# Altium project E17-04-BMS.PrjPcb (part 1 of 2)
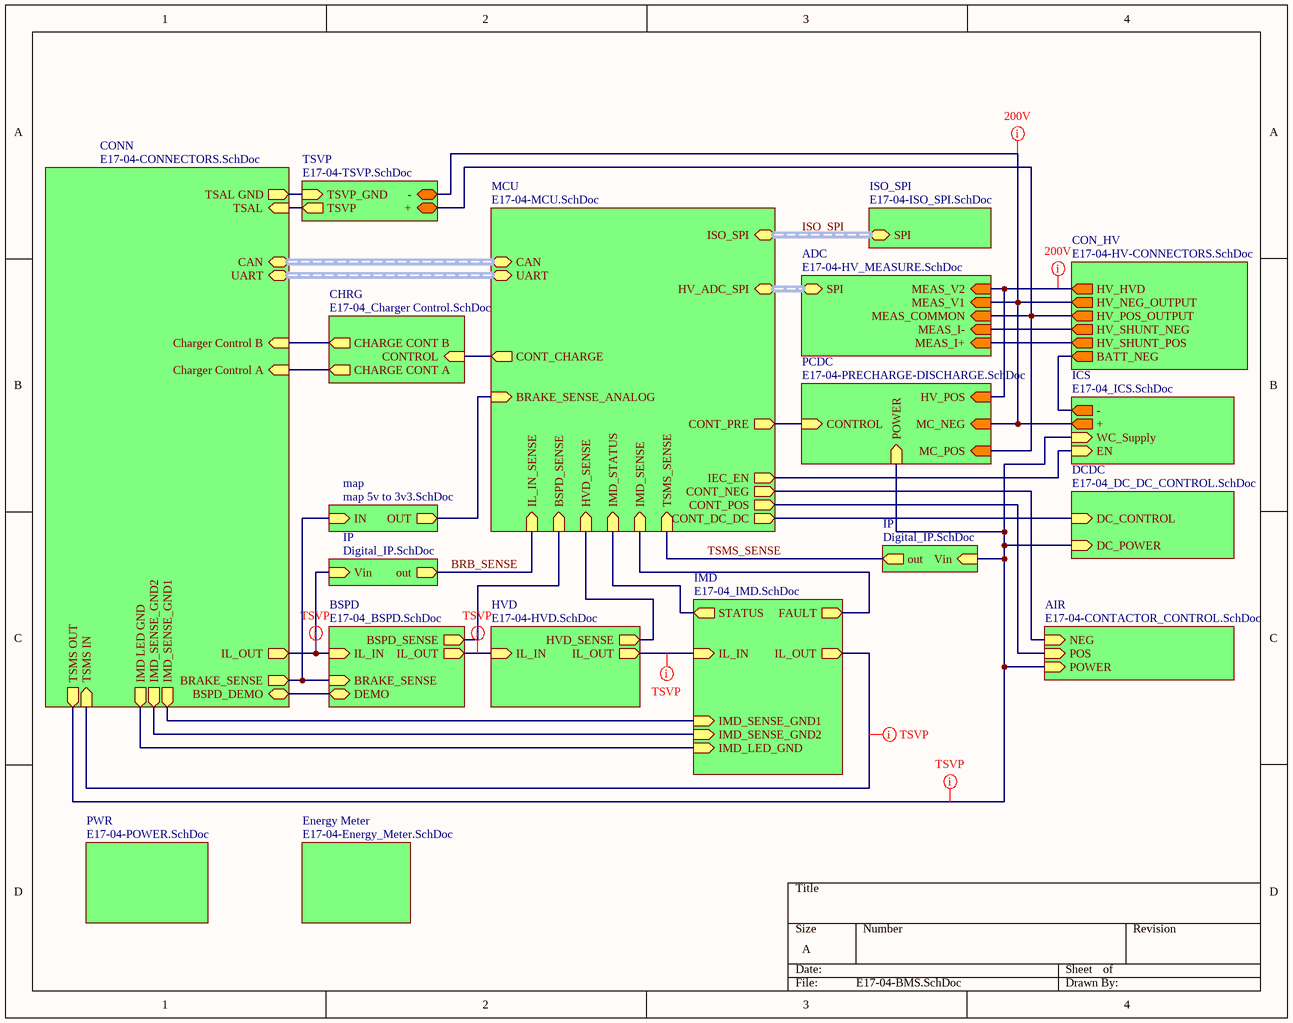
[diagram p0: E17-04-BMS.SchDoc]
20 sheets, 218 parts. Net scope: hierarchical (ports join the sheet entries above them; power ports are global).
Board file: E17-04-PCB.PcbDoc
Sheets:
  E17-04-BMS.SchDoc
    CONN = E17-04-CONNECTORS.SchDoc
      IP = Digital_IP.SchDoc
    BSPD = E17-04_BSPD.SchDoc
      IP = Digital_IP.SchDoc
    IMD = E17-04_IMD.SchDoc
      IP = Digital_IP.SchDoc
      IP = Digital_IP.SchDoc
    PCDC = E17-04-PRECHARGE-DISCHARGE.SchDoc
      SW = E17-04-INDUCTIVE_LOAD_SWITCH.SchDoc
    AIR = E17-04-CONTACTOR_CONTROL.SchDoc
      SW = E17-04-INDUCTIVE_LOAD_SWITCH.SchDoc
      SW = E17-04-INDUCTIVE_LOAD_SWITCH.SchDoc
    ISO_SPI = E17-04-ISO_SPI.SchDoc
    TSVP = E17-04-TSVP.SchDoc
    MCU = E17-04-MCU.SchDoc
    ADC = E17-04-HV_MEASURE.SchDoc
    PWR = E17-04-POWER.SchDoc
    HVD = E17-04-HVD.SchDoc
      IP = Digital_IP.SchDoc
    IP = Digital_IP.SchDoc
    CON_HV = E17-04-HV-CONNECTORS.SchDoc
    CHRG = E17-04_Charger Control.SchDoc
      SW = E17-04-INDUCTIVE_LOAD_SWITCH.SchDoc
    ICS = E17-04_ICS.SchDoc
      SW = E17-04-INDUCTIVE_LOAD_SWITCH.SchDoc
    IP = Digital_IP.SchDoc
    map = map 5v to 3v3.SchDoc
    Energy Meter = E17-04-Energy_Meter.SchDoc
    DCDC = E17-04_DC_DC_CONTROL.SchDoc
      SW = E17-04-INDUCTIVE_LOAD_SWITCH.SchDoc

## Sheet E17-04-BMS.SchDoc
size A; DocumentNumber: 1; SheetNumber: 1; SheetTotal: 18

### Sub-sheets
ADC = E17-04-HV_MEASURE.SchDoc: MEAS_V1 (in), MEAS_I- (in), MEAS_V2 (in), MEAS_I+ (in), MEAS_COMMON (in), SPI (harness SPI)
AIR = E17-04-CONTACTOR_CONTROL.SchDoc: POWER (in), POS (in), NEG (in)
BSPD = E17-04_BSPD.SchDoc: BRAKE_SENSE (in), IL_IN (in), IL_OUT (out), BSPD_SENSE (out), DEMO (bidir)
CHRG = E17-04_Charger Control.SchDoc: CHARGE CONT A (out), CONTROL (in), CHARGE CONT B (out)
CON_HV = E17-04-HV-CONNECTORS.SchDoc: HV_HVD (out), HV_NEG_OUTPUT (out), HV_POS_OUTPUT (out), HV_SHUNT_NEG (out), HV_SHUNT_POS (out), BATT_NEG (out)
CONN = E17-04-CONNECTORS.SchDoc: IL_OUT (out), BRAKE_SENSE (out), IMD LED GND (out), TSAL GND (out), TSAL (in), IMD_SENSE_GND1 (out), IMD_SENSE_GND2 (out), Charger Control A (in), Charger Control B (in), TSMS IN (in), TSMS OUT (out), CAN (harness CAN), UART (harness UART), BSPD_DEMO (bidir)
DCDC = E17-04_DC_DC_CONTROL.SchDoc: DC_CONTROL (in), DC_POWER (in)
Energy Meter = E17-04-Energy_Meter.SchDoc: no entries
HVD = E17-04-HVD.SchDoc: IL_OUT (out), IL_IN (in), HVD_SENSE (out)
ICS = E17-04_ICS.SchDoc: + (out), - (out), EN (in), WC_Supply (in)
IMD = E17-04_IMD.SchDoc: IL_IN (in), IL_OUT (out), FAULT (out), IMD_LED_GND (in), IMD_SENSE_GND2 (in), IMD_SENSE_GND1 (in), STATUS (out)
IP = Digital_IP.SchDoc: Vin (in), out (out)
IP = Digital_IP.SchDoc: Vin (in), out (out)
ISO_SPI = E17-04-ISO_SPI.SchDoc: SPI (harness SPI)
map = map 5v to 3v3.SchDoc: IN (in), OUT (out)
MCU = E17-04-MCU.SchDoc: IMD_SENSE (in), CONT_POS (out), CONT_PRE (out), CONT_NEG (out), IL_IN_SENSE (in), BSPD_SENSE (in), HVD_SENSE (in), TSMS_SENSE (in), CONT_CHARGE (out), IMD_STATUS (in), IEC_EN (out), CAN (harness CAN), HV_ADC_SPI (harness SPI), ISO_SPI (harness SPI), UART (harness UART), BRAKE_SENSE_ANALOG (in), CONT_DC_DC (out)
PCDC = E17-04-PRECHARGE-DISCHARGE.SchDoc: HV_POS (in), MC_POS (in), MC_NEG (in), CONTROL (in), POWER (in)
PWR = E17-04-POWER.SchDoc: no entries
TSVP = E17-04-TSVP.SchDoc: TSVP (out), TSVP_GND (in), -, +

### Nets
HV_COM: sheet PCDC/MC_POS, sheet TSVP/+, sheet ADC/MEAS_COMMON, sheet CON_HV/HV_POS_OUTPUT
+: sheet PCDC/MC_NEG, sheet TSVP/-, sheet ADC/MEAS_V1, sheet CON_HV/HV_NEG_OUTPUT, sheet ICS/+
-: sheet CON_HV/BATT_NEG, sheet ICS/-
~{IMD FAUL}T 3V3: sheet IMD/FAULT, sheet MCU/IMD_SENSE
BRAKE_SENSE: sheet CONN/BRAKE_SENSE, sheet BSPD/BRAKE_SENSE, sheet map/IN
BRAKE_SENSE_ANALOG: sheet MCU/BRAKE_SENSE_ANALOG, sheet map/OUT
BRB_SENSE: sheet MCU/IL_IN_SENSE, sheet IP/out
BSPD_DEMO: sheet CONN/BSPD_DEMO, sheet BSPD/DEMO
BSPD_SENSE: sheet BSPD/BSPD_SENSE, sheet MCU/BSPD_SENSE
CHARGE CONT A: sheet CONN/Charger Control A, sheet CHRG/CHARGE CONT A
CHARGE CONT B: sheet CONN/Charger Control B, sheet CHRG/CHARGE CONT B
CONT_CHARGE: sheet MCU/CONT_CHARGE, sheet CHRG/CONTROL
CONT_DC_DC: sheet MCU/CONT_DC_DC, sheet DCDC/DC_CONTROL
CONT_NEG: sheet AIR/NEG, sheet MCU/CONT_NEG
CONT_POS: sheet AIR/POS, sheet MCU/CONT_POS
CONT_PRE: sheet PCDC/CONTROL, sheet MCU/CONT_PRE
CONTROL: sheet MCU/IEC_EN, sheet ICS/EN
DC_POWER: sheet CONN/TSMS OUT, sheet PCDC/POWER, sheet AIR/POWER, sheet ICS/WC_Supply, sheet IP/Vin, sheet DCDC/DC_POWER
HV_HVD: sheet PCDC/HV_POS, sheet ADC/MEAS_V2, sheet CON_HV/HV_HVD
HV_SHUNT_NEG: sheet ADC/MEAS_I-, sheet CON_HV/HV_SHUNT_NEG
HV_SHUNT_POS: sheet ADC/MEAS_I+, sheet CON_HV/HV_SHUNT_POS
HVD_SENSE: sheet MCU/HVD_SENSE, sheet HVD/HVD_SENSE
IL_IN: sheet CONN/IL_OUT, sheet BSPD/IL_IN, sheet IP/Vin
IL_IN: sheet BSPD/IL_OUT, sheet HVD/IL_IN  [a separate net that carries the same name]
IL_IN: sheet IMD/IL_IN, sheet HVD/IL_OUT  [a separate net that carries the same name]
IL_OUT: sheet CONN/TSMS IN, sheet IMD/IL_OUT
IMD LED GND: sheet CONN/IMD LED GND, sheet IMD/IMD_LED_GND
IMD_SENSE_GND1: sheet CONN/IMD_SENSE_GND1, sheet IMD/IMD_SENSE_GND1
IMD_SENSE_GND2: sheet CONN/IMD_SENSE_GND2, sheet IMD/IMD_SENSE_GND2
IMD_STATUS: sheet IMD/STATUS, sheet MCU/IMD_STATUS
TSAL: sheet CONN/TSAL, sheet TSVP/TSVP
TSAL GND: sheet CONN/TSAL GND, sheet TSVP/TSVP_GND
TSMS_SENSE: sheet MCU/TSMS_SENSE, sheet IP/out

### Buses and harness runs
harness ISO_SPI = sheet ISO_SPI/SPI = sheet MCU/ISO_SPI
harness sheet ADC/SPI = sheet MCU/HV_ADC_SPI
harness sheet CONN/CAN = sheet MCU/CAN
harness sheet CONN/UART = sheet MCU/UART

### Layout directives
rule Clearance Constraint [Generic clearance = 0.4mm, and 3 value(s) for objects]: +, HV_HVD
rule Undefined; rule Width Constraint [Pref Width = 25mil    Min Width = 20mil    Max Width = 30mil]: DC_POWER, IL_IN, IL_OUT

## Sheet E17-04-CONNECTORS.SchDoc
size A; DocumentNumber: 11; SheetNumber: 11; SheetTotal: 18
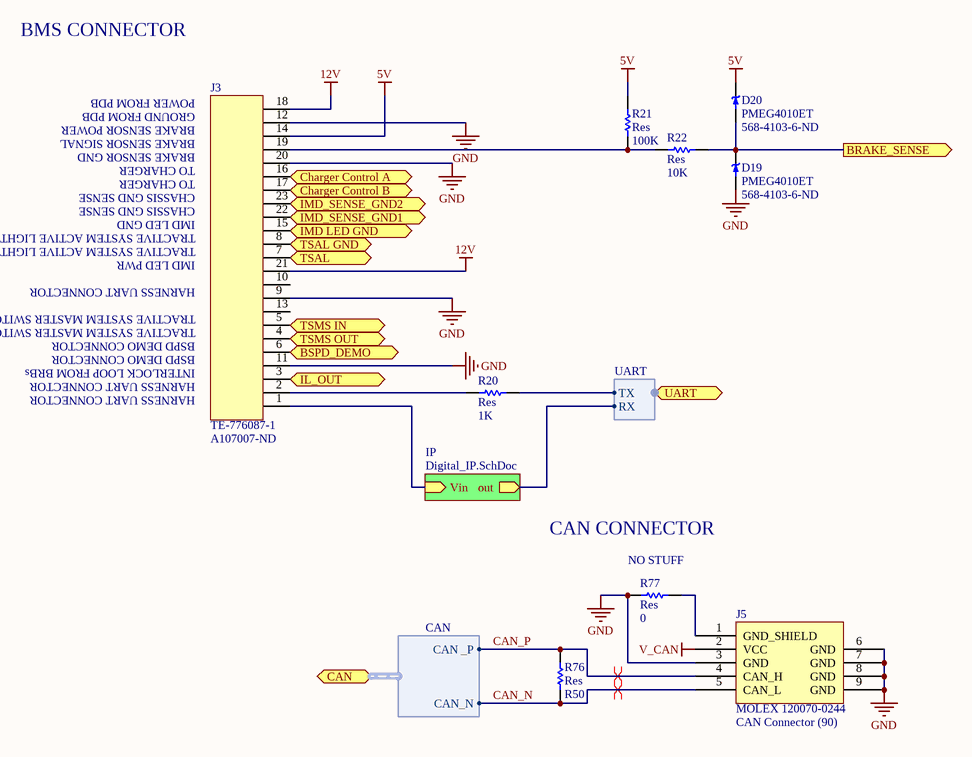
[diagram p1: E17-04-CONNECTORS.SchDoc]

### Parts
D19  PMEG4010ET  Supplier Part Number 1: 568-4103-6-ND  [SOT23-3]
D20  PMEG4010ET  Supplier Part Number 1: 568-4103-6-ND  [SOT23-3]
J3  TE-776087-1  Supplier Part Number 1: A107007-ND  [TE-776087-1]
J5  CAN Connector (90)  [CAN Connector (90)]
R20  Res  value 1K  [2012[0805]]
R21  Res  value 100K  [2012[0805]]
R22  Res  value 10K  [2012[0805]]
R76  Res  value R50  [2012[0805]]
R77  Res  value 0  [2012[0805]]

### Sub-sheets
IP = Digital_IP.SchDoc: Vin (in), out (out)

### Ports
BRAKE_SENSE (out), BSPD_DEMO (bidir), CAN (harness CAN), Charger Control A (out), Charger Control B (out), IL_OUT (out), IMD LED GND (out), IMD_SENSE_GND1 (out), IMD_SENSE_GND2 (out), TSAL (in), TSAL GND (in), TSMS IN, TSMS OUT, UART (harness UART)

### Harnesses
CAN: CAN _P, CAN_N
UART: RX, TX

### Nets
5V: D20.3 J3.14 R21.1
12V: J3.18 J3.21
GND: D19.1 J3.9 J3.11 J3.12 J3.20 J5.3(GND) J5.6(GND) J5.7(GND) J5.8(GND) J5.9(GND) R77.2
V_CAN: J5.2(VCC)
BRAKE_SENSE: D19.3 D20.1 R22.2 ; port BRAKE_SENSE
BSPD_DEMO: J3.6 ; port BSPD_DEMO
CAN_N: J5.5(CAN_L) R76.1 ; port CAN.CAN_N
CAN_P: J5.4(CAN_H) R76.2 ; port CAN.CAN _P
CHARGE CONT A: J3.16 ; port Charger Control A
CHARGE CONT B: J3.17 ; port Charger Control B
DC_POWER: J3.4 ; port TSMS OUT
IL_IN: J3.3 ; port IL_OUT
IL_OUT: J3.5 ; port TSMS IN
IMD LED GND: J3.15 ; port IMD LED GND
IMD_SENSE_GND1: J3.22 ; port IMD_SENSE_GND1
IMD_SENSE_GND2: J3.23 ; port IMD_SENSE_GND2
out: sheet IP/out, port UART.RX
TSAL: J3.7 ; port TSAL
TSAL GND: J3.8 ; port TSAL GND
Vin: J3.1 ; sheet IP/Vin
NetJ3_2: J3.2 R20.1
NetJ3_19: J3.19 R21.2 R22.1
NetJ5_1: J5.1(GND_SHIELD) R77.1
NetPB1_58: R20.2 ; port UART.TX

Not connected (* = marked no-connect by the designer): J3 10 13

### Layout directives
differential pair: CAN_N, CAN_P

### Notes on the sheet
- BMS CONNECTOR
- POWER FROM PDB
- GROUND FROM PDB
- BRAKE SENSOR POWER
- BRAKE SENSOR SIGNAL
- BRAKE SENSOR GND
- TO CHARGER
- CHASSIS GND SENSE
- IMD LED GND
- TRACTIVE SYSTEM ACTIVE LIGHT
- IMD LED PWR
- TRACTIVE SYSTEM MASTER SWITCH
- HARNESS UART CONNECTOR
- INTERLOCK LOOP FROM BRBs
- BSPD DEMO CONNECTOR
- CAN CONNECTOR
- (near R77) NO STUFF
- (in symbol CAN Connector (90)) MOLEX 120070-0244

### Library data of the parts
D19 D20 = PMEG4010ET: SCHOTTKY RECT 40V 1A SOT-23; Supplier 1: Digi-Key
J3 = TE-776087-1: CONN HDR RTANG 23POS W/GASKT TIN; Supplier 1: Digi-Key
R20-R22 R76 R77 = Res: Surface Mount Resistor; Published: 8-Jun-2000; LatestRevisionDate: 17-Jul-2002; LatestRevisionNote: Re-released for DXP Platform.; PackageReference: AXIAL-0.5; Publisher: Altium Limited
J5 = CAN Connector (90): Supplier 1: Mouser

## Sheet Digital_IP.SchDoc
size A; DocumentNumber: 15; SheetNumber: 15; SheetTotal: 18
Used 7 times, as channels CONN/IP, BSPD/IP, IMD/IP, IMD/IP, HVD/IP, IP, IP. Parts and nets are listed once, with the designators drawn on the sheet.
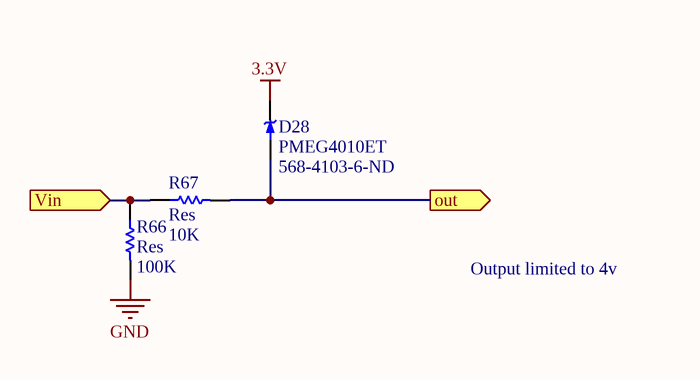
[diagram p2: Digital_IP.SchDoc]

### Parts
D28  PMEG4010ET  Supplier Part Number 1: 568-4103-6-ND  [SOT23-3]
R66  Res  value 100K  [2012[0805]]
R67  Res  value 10K  [2012[0805]]

### Ports
out (out), Vin (in)

### Nets
3.3V: D28.3
GND: R66.2
out: D28.1 R67.2 ; port out
Vin: R66.1 R67.1 ; port Vin

### Channels
CONN/IP: designators end in _CONN_IP; ports out=out Vin=Vin
BSPD/IP: designators D28=D17_IP1 R66=R66_BSPD_IP R67=R35_IP1; ports out=BSPD_SENSE Vin=IL_IN
IMD/IP: designators D28=D17_IP4 R66=R66_IMD_IP#1 R67=R35_IP4; ports out=~{IMD FAUL}T 3V3 Vin=~{IMD FAUL}T 12V
IMD/IP: designators D28=D17_IP3 R66=R66_IMD_IP#2 R67=R35_IP3; ports out=IMD_STATUS Vin=IMD_PWM+
HVD/IP: designators D28=D17_IP2 R66=R66_HVD_IP R67=R35_IP2; ports out=HVD_SENSE Vin=IL_IN
IP: designators D28=D17_IP5 R66=R66_IP#1 R67=R35_IP5; ports out=BRB_SENSE Vin=IL_IN
IP: designators D28=D17_IP6 R66=R66_IP#2 R67=R35_IP6; ports out=TSMS_SENSE Vin=DC_POWER

### Notes on the sheet
- Output limited to 4v

### Library data of the parts
D28 = PMEG4010ET: SCHOTTKY RECT 40V 1A SOT-23; Supplier 1: Digi-Key
R66 R67 = Res: Surface Mount Resistor; Published: 8-Jun-2000; LatestRevisionDate: 17-Jul-2002; LatestRevisionNote: Re-released for DXP Platform.; PackageReference: AXIAL-0.5; Publisher: Altium Limited

## Sheet E17-04_BSPD.SchDoc
size B; DocumentNumber: 10; SheetNumber: 10; SheetTotal: 18
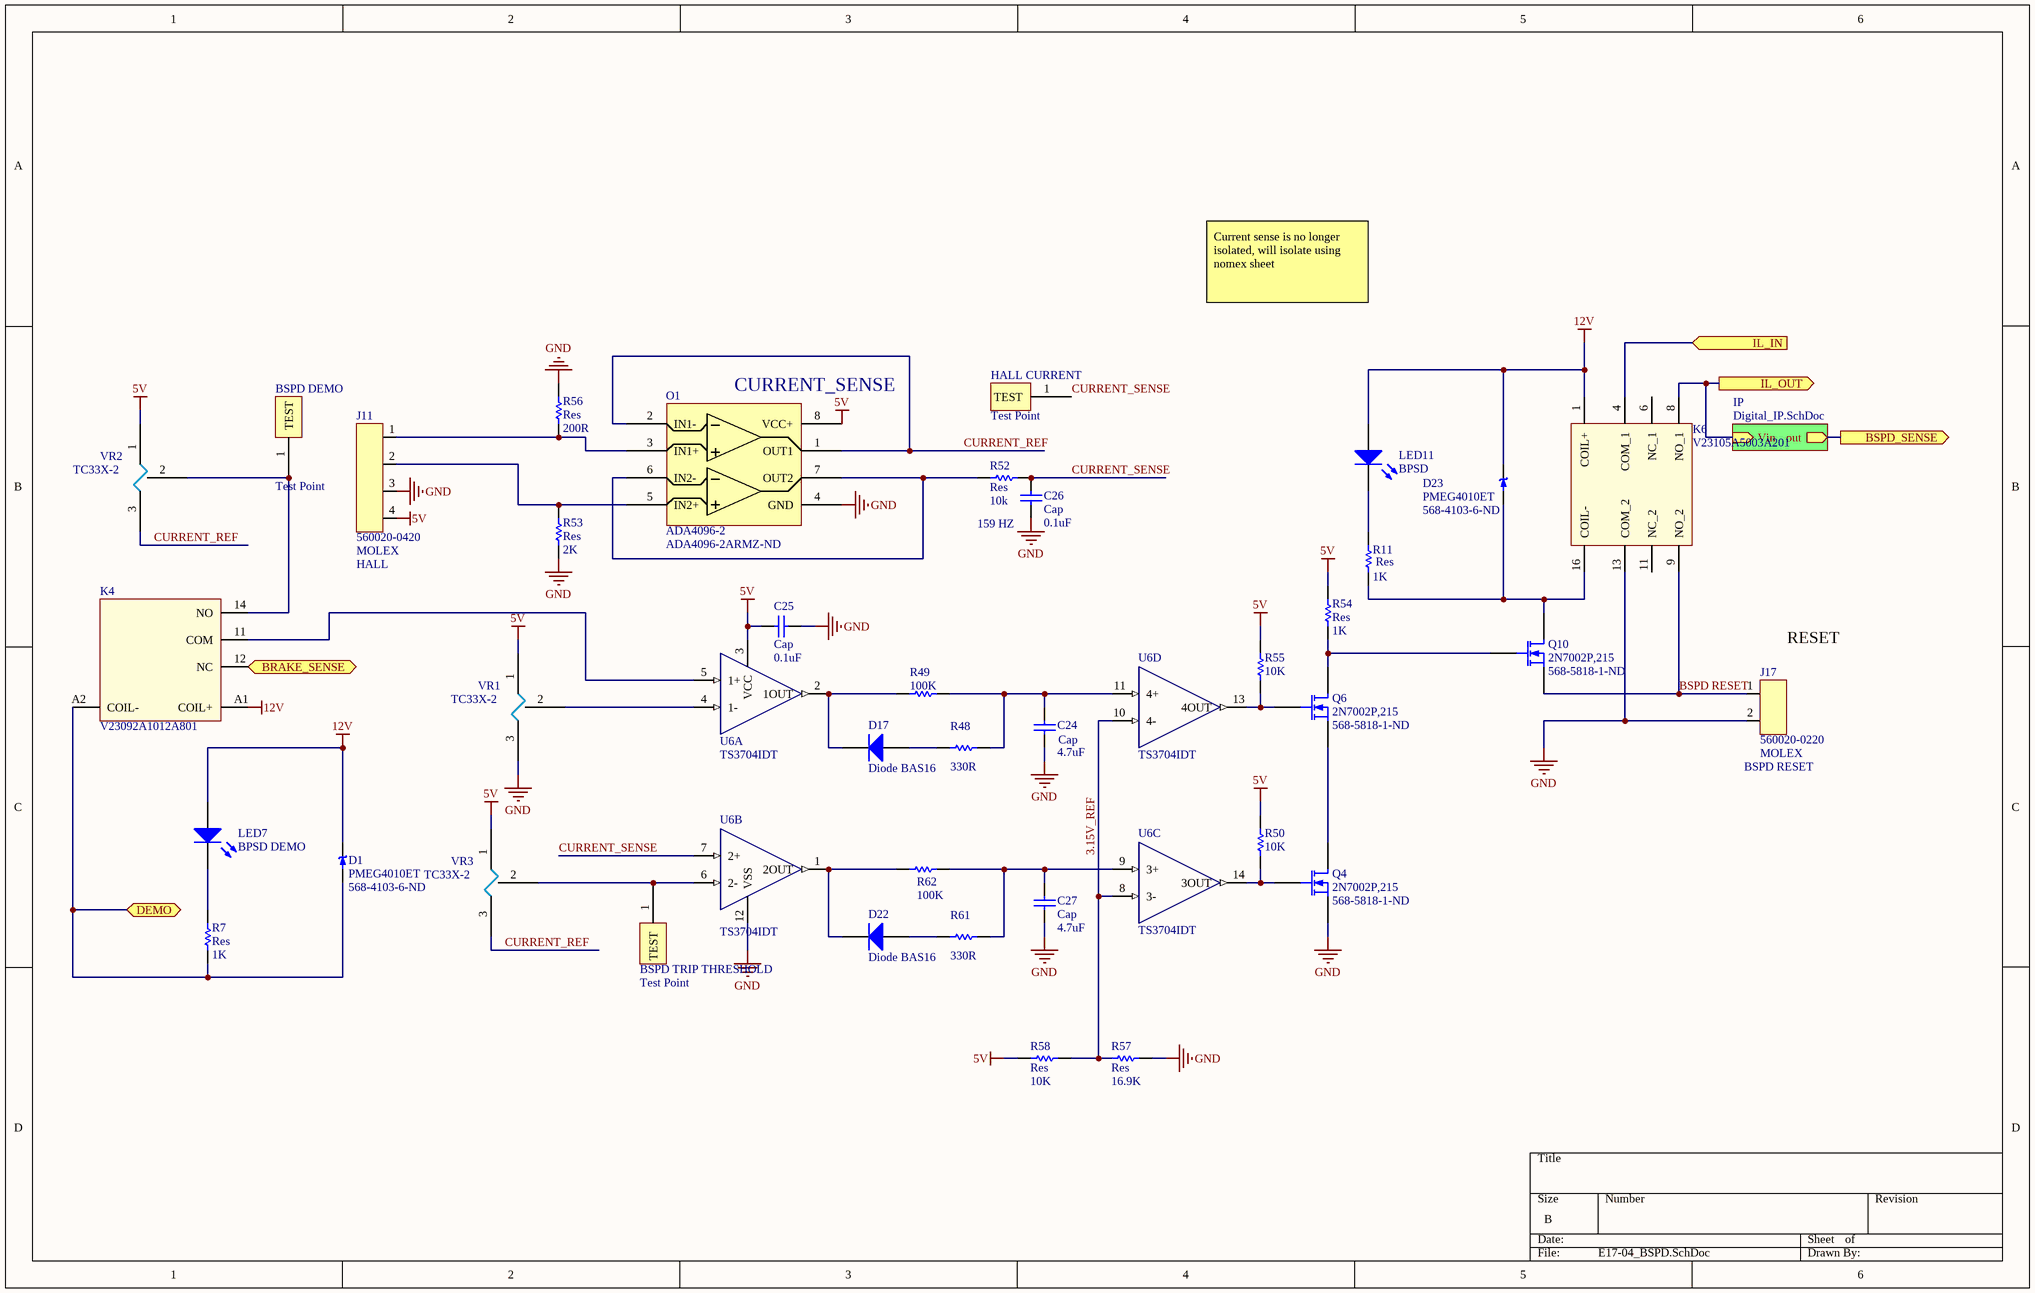
[diagram p3: E17-04_BSPD.SchDoc]

### Parts
BSPD_DEMO  Test Point  [TEST POINT 5000K]
BSPD_TRIP_THRESHOLD  Test Point  [TEST POINT 5000K]
C24  Cap  value 4.7uF  [C0805]
C25  Cap  value 0.1uF  [C0805]
C26  Cap  value 0.1uF  [C0805]
C27  Cap  value 4.7uF  [C0805]
D1  PMEG4010ET  Supplier Part Number 1: 568-4103-6-ND  [SOT23-3]
D17  Diode BAS16  [SOT-23_N]
D22  Diode BAS16  [SOT-23_N]
D23  PMEG4010ET  Supplier Part Number 1: 568-4103-6-ND  [SOT23-3]
HALL_CURRENT  Test Point  [TEST POINT 5000K]
J11  MANUFACTURER: MOLEX  [MOLEX_DURACLIK_4 NAT VERT]  (hidden comment: HALL)
J17  BSPD RESET  MANUFACTURER: MOLEX  [MOLEX_DURACLIK_2 NAT VERT]
K4  V23092A1012A801  [SCHRACK]
K6  MFG_PN: V23105A5003A201  [K_V23105A5003A201]  (hidden comment: K_V23105A5003A201)
LED7  BPSD DEMO  [155124VS73200]
LED11  BPSD  [155124VS73200]
O1  ADA4096-2  Supplier Part Number 1: ADA4096-2ARMZ-ND  [TSSOP8]
Q4  2N7002P,215  Supplier Part Number 1: 568-5818-1-ND  [SOT23-3]
Q6  2N7002P,215  Supplier Part Number 1: 568-5818-1-ND  [SOT23-3]
Q10  2N7002P,215  Supplier Part Number 1: 568-5818-1-ND  [SOT23-3]
R7  Res  value 1K  [2012[0805]]
R11  Res  value 1K  [2012[0805]]
R48  value 330R  [2012[0805]]  (hidden comment: Res)
R49  value 100K  [2012[0805]]  (hidden comment: Res)
R50  value 10K  [2012[0805]]  (hidden comment: Res)
R52  Res  value 10k  [2012[0805]]
R53  Res  value 2K  [2012[0805]]
R54  Res  value 1K  [2012[0805]]
R55  value 10K  [2012[0805]]  (hidden comment: Res)
R56  Res  value 200R  [2012[0805]]
R57  Res  value 16.9K  [2012[0805]]
R58  Res  value 10K  [2012[0805]]
R61  value 330R  [2012[0805]]  (hidden comment: Res)
R62  value 100K  [2012[0805]]  (hidden comment: Res)
U6  MFG_PN: TS3704IDT  [14-SOIC]  (hidden comment: U_TS3704IDT)  (parts A,B,C,D of 4)
VR1  TC33X-2  [TC33X-2]
VR2  TC33X-2  [TC33X-2]
VR3  TC33X-2  [TC33X-2]

### Sub-sheets
IP = Digital_IP.SchDoc: Vin (in), out (out)

### Ports
BRAKE_SENSE (in), BSPD_SENSE (out), DEMO (bidir), IL_IN (in), IL_OUT (out)

### Nets
5V: C25.2 J11.4 O1.8(VCC+) R50.2 R54.1 R55.2 R58.2 U6.3(VCC) VR1.1 VR2.1 VR3.1
12V: D1.3 D23.3 K4.A1(COIL+) K6.1(COIL+) LED7.2 LED11.2
GND: C24.1 C25.1 C26.1 C27.1 J11.3 J17.2 K6.13(COM_2) O1.4(GND) Q4.2(S) R53.1 R56.1 R57.1 U6.12(VSS) VR1.3
3.15V_REF: R57.2 R58.1 U6.8(3-) U6.10(4-)
BRAKE_SENSE: K4.12(NC) ; port BRAKE_SENSE
BSPD RESET: J17.1 K6.9(NO_2) Q10.2(S)
BSPD_DEMO: D1.1 K4.A2(COIL-) R7.1 ; port DEMO
BSPD_SENSE: port BSPD_SENSE, sheet IP/out
CURRENT_REF: O1.1(OUT1) O1.2(IN1-) VR2.3 VR3.3
CURRENT_SENSE: C26.2 HALL_CURRENT.1(TEST) R52.1 U6.7(2+)
IL_IN: K6.4(COM_1) ; port IL_IN
IL_IN: K6.8(NO_1) ; port IL_OUT, sheet IP/Vin  [a separate net that carries the same name]
NetBSPD_DEMO_1: BSPD_DEMO.1(TEST) K4.14(NO) VR2.2
NetBSPD_TRIP_THRESHOLD_1: BSPD_TRIP_THRESHOLD.1(TEST) U6.6(2-) VR3.2
NetC24_2: C24.2 R48.2 R49.2 U6.11(4+)
NetC27_2: C27.2 R61.2 R62.2 U6.9(3+)
NetD17_1: D17.1(A) R48.1
NetD17_3: D17.3(K) R49.1 U6.2(1OUT)
NetD22_1: D22.1(A) R61.1
NetD22_3: D22.3(K) R62.1 U6.1(2OUT)
NetD23_1: D23.1 K6.16(COIL-) Q10.3(D) R11.1
NetJ11_1: J11.1 O1.3(IN1+) R56.2
NetJ11_2: J11.2 O1.5(IN2+) R53.2
NetK4_11: K4.11(COM) U6.5(1+)
NetLED7_1: LED7.1 R7.2
NetLED11_1: LED11.1 R11.2
NetO1_6: O1.6(IN2-) O1.7(OUT2) R52.2
NetQ4_1: Q4.1(G) R50.1 U6.14(3OUT)
NetQ4_3: Q4.3(D) Q6.2(S)
NetQ6_1: Q6.1(G) R55.1 U6.13(4OUT)
NetQ6_3: Q6.3(D) Q10.1(G) R54.2
NetU6_4: U6.4(1-) VR1.2

Not connected (* = marked no-connect by the designer): K6 6(NC_1) 11(NC_2)

### Notes on the sheet
- Current sense is no longer isolated, will isolate using nomex sheet
- (near O1) CURRENT_SENSE
- (near C26) 159 HZ
- (near J17) RESET

### Library data of the parts
BSPD_DEMO BSPD_TRIP_THRESHOLD HALL_CURRENT = Test Point: 5000-5004, 5015-5019 Keystone Electronics
C24-C27 = Cap: Capacitor; Published: 8-Jun-2000; LatestRevisionDate: 17-Jul-2002; LatestRevisionNote: Re-released for DXP Platform.; PackageReference: C1206; Publisher: Altium Limited
D1 D23 = PMEG4010ET: SCHOTTKY RECT 40V 1A SOT-23; Supplier 1: Digi-Key
D17 D22 = Diode BAS16: Silicon Switching Diode for High-Speed Switching; Note: Pin 2 is not connected and not drawn.; Published: 21-Mar-2003; LatestRevisionDate: 29-May-2009; LatestRevisionNote: IPC-7351 Footprint Added.; DatasheetVersion: Oct-1999; PackageVersion: Sep-2001; PackageReference: SOT-23; Publisher: Altium Limited; PackageDescription: 3-Pin SOT-23 Package 0.95 mm Pitch, 2.5 mm Lead Span; ComponentLink1Description: Manufacturer Link; ComponentLink1URL: http://www.infineon.com/; ComponentLink2Description: Datasheet; ComponentLink2URL: http://www.infineon.com/upload/Document/cmc_upload/documents/012/5331/bas16series.pdf
J11 = 560020-0420: MOLEX DURACLIK 4-PIN VERT NAT; POSITIONS: 4; UL: 94V-0; VOLTAGE: 125; CURRENT: 3; PLATING: Tin (Sn); Digikey_PN: Not in production; COLOR: NAT; SERIES: Duraclik; ORIENTATOIN: VERT; MPN: 560020-0420; COMMENT_1: HALL; Comment_2: 560020-0420
J17 = 560020-0220: MOLEX DURACLIK 2-PIN VERT NAT; POSITIONS: 2; UL: 94V-0; VOLTAGE: 125; CURRENT: 3; PLATING: Tin (Sn); Digikey_PN: Not in production; COLOR: NAT; SERIES: Duraclik; ORIENTATOIN: VERT; MPN: 560020-0220; Comment_1: BSPD RESET
K4 = V23092A1012A801: 12V slim SPDT Relay; MFG: TE; DC Contact Voltage: 300; Coil Voltage: 12; Coil Current: 0.0142; DIGIKEY_PN: PB2044-ND; Supplier 1: Digikey; Supplier Part Number 1: PB2044-ND; MFG_PN: V23092A1012A801
K6 = K_V23105A5003A201: RELAY DPDT 12V/12.5mA, 220V/3A; MFG: TE; DIGIKEY_PN: PB384-ND
LED7 LED11 = 155124VS73200: Right Angle SMD Green 2V; Manufacturer: Wurth Electronics Inc; Lens Color: Colorless; Lens Transparency: Clear; Millicandela Rating: 50mcd; Lens Style/Size: Rectangle with Domed Top, 2.00mm x 1.00mm; Current - Test: 20mA; Viewing Angle: 120°; Wavelength - Dominant: 573nm; Wavelength - Peak: 575nm; Supplier 1: Digi-Key; Supplier Part Number 1: 732-5026-1-ND; RoHS: RoHS Compliant; Category: Optoelectronics; Stock 1: 4820; Pricing 1: 1=0.44, 50=0.3802, 100=0.3476, 500=0.31498, 1000=0.29326 (CAD); Packaging: Cut Tape (CT); Color: Green; Voltage - Forward (Vf) (Typ): 2V; Mounting Type: Surface Mount, Right Angle; Features: -; Package / Case: 2-SMD, Side View; Supplier Device Package: 1204; Size / Dimension: 3.20mm L x 1.50mm W; Height (Max): 1.20mm; ComponentLink1URL: http://katalog.we-online.de/led/datasheet/155124VS73200.pdf; ComponentLink1Description: http://katalog.we-online.de/led/datasheet/155124VS73200.pdf; Manufacturer Part Number: 155124VS73200
O1 = ADA4096-2: 2 Op-Amps, 8-TSSOP, 32V Overvoltage Protection; Supplier 1: Digi-Key
Q4 Q6 Q10 = 2N7002P,215: N-Channel Enhancement Mode Vertical DMOS FET; PackageReference: SOT23; PackageDescription: SOT-23; 3 Leads; Body 3.1 x 2.5 mm, inc. leads (LxW max), Alternate Lead Configuration; Supplier 1: Digi-Key
R7 R11 R48-R50 R52-R58 R61 R62 = Res: Surface Mount Resistor; Published: 8-Jun-2000; LatestRevisionDate: 17-Jul-2002; LatestRevisionNote: Re-released for DXP Platform.; PackageReference: AXIAL-0.5; Publisher: Altium Limited
U6 = U_TS3704IDT: QUAD COMPARATOR 14-SOIC PUSH-PULL; MFG: STMicroelectronics; DIGIKEY_PN: 497-2269-1-ND
VR1-VR3 = TC33X-2: Supplier 1: Digi-Key; Supplier Part Number 1: TC33X-103ETR-ND

## Sheet E17-04_IMD.SchDoc
size A; DocumentNumber: 12; SheetNumber: 12; SheetTotal: 18
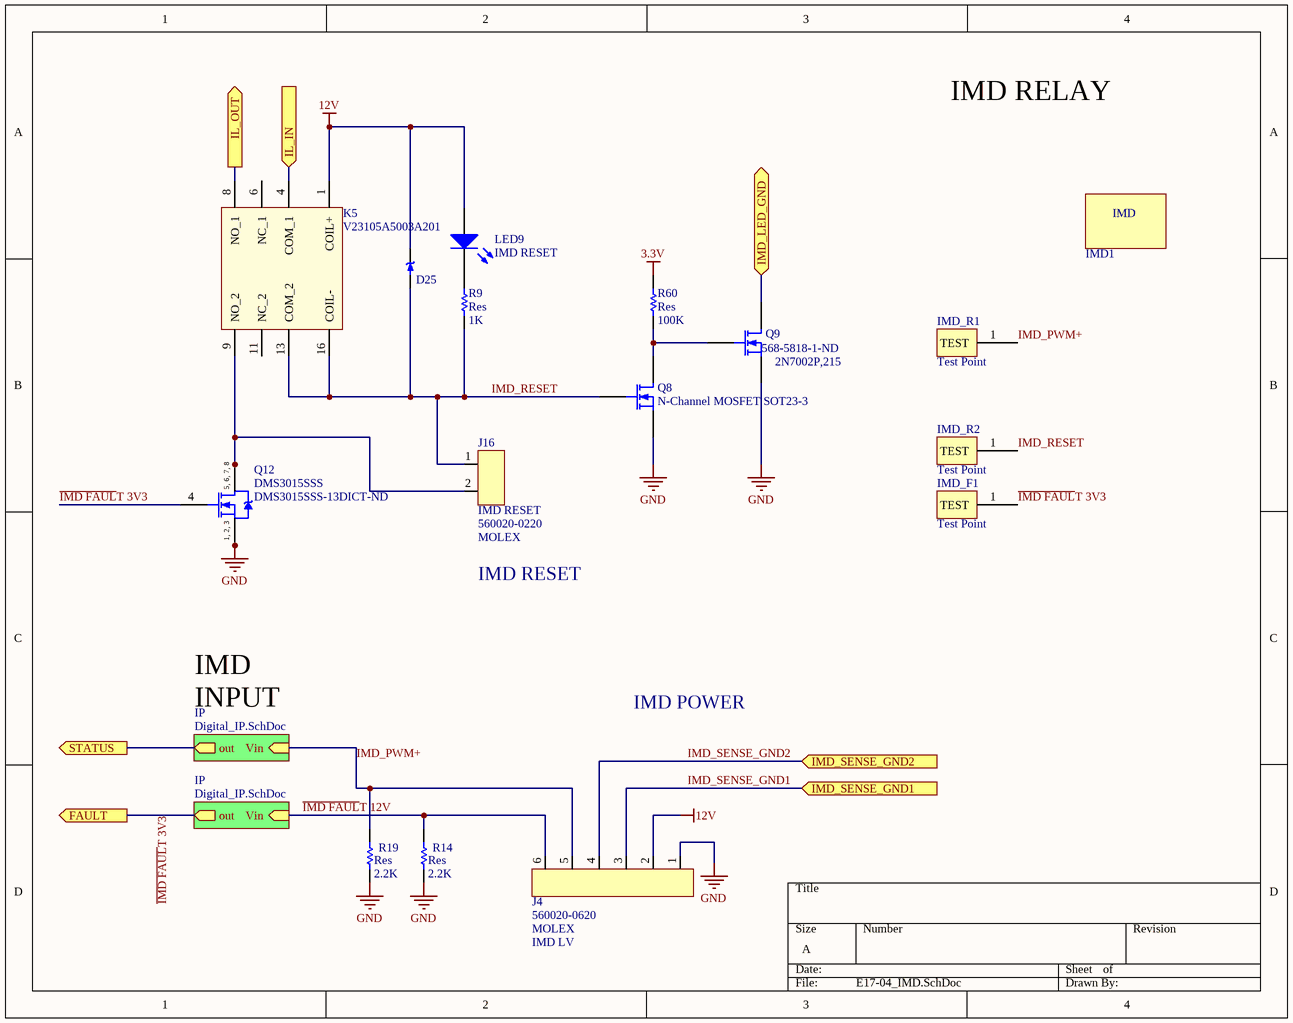
[diagram p4: E17-04_IMD.SchDoc]

### Parts
D25  PMEG4010ET  [SOT23-3]  (value not drawn)
IMD1  ISOMETER IR155-3203  [ISOMETER_IR155]  (value not drawn)
IMD_F1  Test Point  [TEST POINT 5000K]
IMD_R1  Test Point  [TEST POINT 5000K]
IMD_R2  Test Point  [TEST POINT 5000K]
J4  IMD LV  MANUFACTURER: MOLEX  [MOLEX_DURACLIK_6 NAT VERT]
J16  IMD RESET  MANUFACTURER: MOLEX  [MOLEX_DURACLIK_2 NAT VERT]
K5  MFG_PN: V23105A5003A201  [K_V23105A5003A201]  (hidden comment: K_V23105A5003A201)
LED9  IMD RESET  [155124VS73200]
Q8  N-Channel MOSFET SOT23-3  [SOT23-3]
Q9  2N7002P,215  Supplier Part Number 1: 568-5818-1-ND  [SOT23-3]
Q12  DMS3015SSS  Supplier Part Number 1: DMS3015SSS-13DICT-ND  [SOIC-8-150]
R9  Res  value 1K  [2012[0805]]
R14  Res  value 2.2K  [2012[0805]]
R19  Res  value 2.2K  [2012[0805]]
R60  Res  value 100K  [2012[0805]]

### Sub-sheets
IP = Digital_IP.SchDoc: Vin (in), out (out)
IP = Digital_IP.SchDoc: Vin (in), out (out)

### Ports
FAULT (out), IL_IN (in), IL_OUT (out), IMD_LED_GND, IMD_SENSE_GND1 (in), IMD_SENSE_GND2 (in), STATUS (out)

### Nets
3.3V: R60.1
12V: D25.3 J4.2 K5.1(COIL+) LED9.2
GND: J4.1 Q8.2(S) Q9.2(S) Q12.1(S) Q12.2(S) Q12.3(S) R14.2 R19.2
~{IMD FAUL}T 3V3: IMD_F1.1(TEST) Q12.4(G) ; port FAULT, sheet IP/out
~{IMD FAUL}T 12V: J4.6 R14.1 ; sheet IP/Vin
IL_IN: K5.4(COM_1) ; port IL_IN
IL_OUT: K5.8(NO_1) ; port IL_OUT
IMD LED GND: Q9.3(D) ; port IMD_LED_GND
IMD_PWM+: IMD_R1.1(TEST) J4.5 R19.1 ; sheet IP/Vin
IMD_RESET: D25.1 IMD_R2.1(TEST) J16.1 K5.13(COM_2) K5.16(COIL-) Q8.1(G) R9.2
IMD_SENSE_GND1: J4.3 ; port IMD_SENSE_GND1
IMD_SENSE_GND2: J4.4 ; port IMD_SENSE_GND2
IMD_STATUS: port STATUS, sheet IP/out
NetJ16_2: J16.2 K5.9(NO_2) Q12.5(D) Q12.6(D) Q12.7(D) Q12.8(D)
NetLED9_1: LED9.1 R9.1
NetQ8_3: Q8.3(D) Q9.1(G) R60.2

Not connected (* = marked no-connect by the designer): K5 6(NC_1) 11(NC_2)

### Notes on the sheet
- IMD RELAY
- IMD RESET
- IMD
  INPUT
- IMD POWER
- (in symbol Bender ISOMETER IR155-3203) IMD
- (in symbol DMS3015SSS) 5, 6, 7, 8; 1, 2, 3

### Library data of the parts
D25 = PMEG4010ET: SCHOTTKY RECT 40V 1A SOT-23; Supplier 1: Digi-Key; Supplier Part Number 1: 568-4103-6-ND
IMD1 = Bender ISOMETER IR155-3203
IMD_F1 IMD_R1 IMD_R2 = Test Point: as BSPD_DEMO on sheet E17-04_BSPD
J4 = 560020-0620: MOLEX DURACLIK 6-PIN VERT NAT; POSITIONS: 6; UL: 94V-0; VOLTAGE: 125; CURRENT: 3; PLATING: Tin (Sn); Digikey_PN: Not in production; COLOR: NAT; SERIES: Duraclik; ORIENTATOIN: VERT; MPN: 560020-0620
J16 = 560020-0220: as J17 on sheet E17-04_BSPD; Digikey_PN: Not in production; COLOR: NAT; SERIES: Duraclik; ORIENTATOIN: VERT; MPN: 560020-0220; Comment_1: 560020-0220
K5 = K_V23105A5003A201: RELAY DPDT 12V/12.5mA, 220V/3A; MFG: TE; DIGIKEY_PN: PB384-ND
LED9 = 155124VS73200: as LED7 on sheet E17-04_BSPD; Supplier 1: Digi-Key; Supplier Part Number 1: 732-5026-1-ND; RoHS: RoHS Compliant; Category: Optoelectronics; Stock 1: 4820; Pricing 1: 1=0.44, 50=0.3802, 100=0.3476, 500=0.31498, 1000=0.29326 (CAD); Packaging: Cut Tape (CT); Color: Green; Voltage - Forward (Vf) (Typ): 2V; Mounting Type: Surface Mount, Right Angle; Features: -; Package / Case: 2-SMD, Side View; Supplier Device Package: 1204; Size / Dimension: 3.20mm L x 1.50mm W; Height (Max): 1.20mm; ComponentLink1URL: http://katalog.we-online.de/led/datasheet/155124VS73200.pdf; ComponentLink1Description: http://katalog.we-online.de/led/datasheet/155124VS73200.pdf; Manufacturer Part Number: 155124VS73200
Q8 = MOSFET-N SOT23-3
Q9 = 2N7002P,215: as Q4 on sheet E17-04_BSPD; PackageReference: SOT23; PackageDescription: SOT-23; 3 Leads; Body 3.1 x 2.5 mm, inc. leads (LxW max), Alternate Lead Configuration; Supplier 1: Digi-Key
Q12 = DMS3015SSS: N-Channel Power MOSFET; Supplier 1: Digi-Key
R9 R14 R19 R60 = Res: Surface Mount Resistor; Published: 8-Jun-2000; LatestRevisionDate: 17-Jul-2002; LatestRevisionNote: Re-released for DXP Platform.; PackageReference: AXIAL-0.5; Publisher: Altium Limited

## Sheet E17-04-PRECHARGE-DISCHARGE.SchDoc
size A; DocumentNumber: 7; SheetNumber: 7; SheetTotal: 18
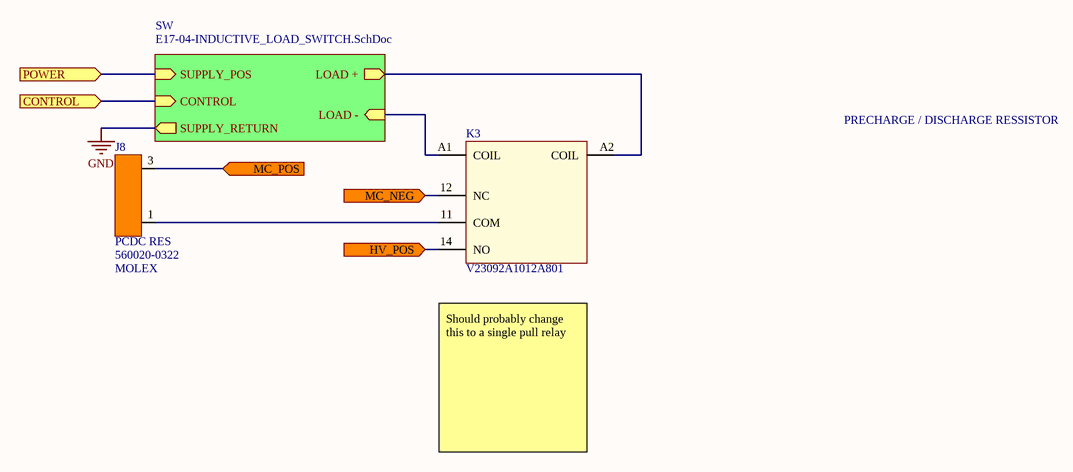
[diagram p5: E17-04-PRECHARGE-DISCHARGE.SchDoc]

### Parts
J8  PCDC RES  MPN: 560020-0322  MANUFACTURER: MOLEX  [MOLEX_DURACLIK_3 RED - VERT  HV]
K3  V23092A1012A801  [SCHRACK]

### Sub-sheets
SW = E17-04-INDUCTIVE_LOAD_SWITCH.SchDoc: CONTROL (in), LOAD + (out), SUPPLY_POS (in), LOAD - (in), SUPPLY_RETURN (out)

### Ports
CONTROL (in), HV_POS (in), MC_NEG (in), MC_POS (in), POWER (in)

### Nets
HV_COM: J8.3 ; port MC_POS
+: K3.12(NC) ; port MC_NEG
CONT_PRE: port CONTROL, sheet SW/CONTROL
DC_POWER: K3.A2(COIL) ; port POWER, sheet SW/LOAD +, sheet SW/SUPPLY_POS
HV_HVD: K3.14(NO) ; port HV_POS
LOAD -: K3.A1(COIL) ; sheet SW/LOAD -
NetJ8_1: J8.1 K3.11(COM)

### Notes on the sheet
- PRECHARGE / DISCHARGE RESSISTOR
- Should probably change this to a single pull relay

### Library data of the parts
J8 = 560020-0322_HV: MOLEX DURACLIK 3-PIN VERT RED HV; POSITIONS: 2; PLATING: Tin (Sn); CURRENT: 3; VOLTAGE: 250; UL: 94V-0; Digikey_PN: Not in production; COLOR: RED; SERIES: Duraclik; ORIENTATOIN: VERT; Comment_1: 560020-0322_HV
K3 = V23092A1012A801: as K4 on sheet E17-04_BSPD; DIGIKEY_PN: PB2044-ND; Supplier 1: Digikey; Supplier Part Number 1: PB2044-ND; MFG_PN: V23092A1012A801

## Sheet E17-04-INDUCTIVE_LOAD_SWITCH.SchDoc
size A; DocumentNumber: 7; SheetNumber: 7; SheetTotal: 9
Used 6 times, as channels PCDC/SW, AIR/SW, AIR/SW, CHRG/SW, ICS/SW, DCDC/SW. Parts and nets are listed once, with the designators drawn on the sheet.
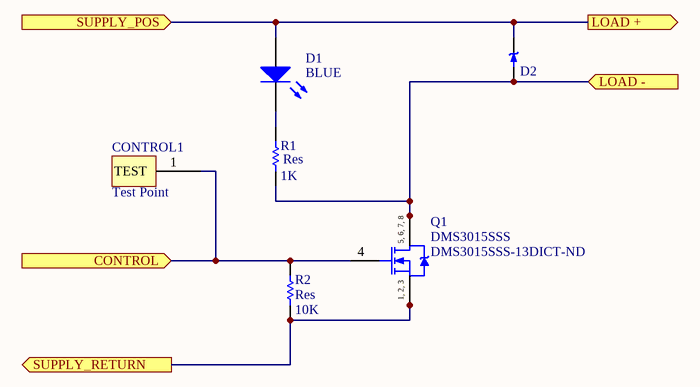
[diagram p6: E17-04-INDUCTIVE_LOAD_SWITCH.SchDoc]

### Parts
CONTROL1  Test Point  [TEST POINT 5000K]
D1  Colour: BLUE  [OVS5MBBCR4]  (hidden comment: OVS5MBBCR4)
D2  PMEG4010ET  [SOT23-3]  (value not drawn)
Q1  DMS3015SSS  Supplier Part Number 1: DMS3015SSS-13DICT-ND  [SOIC-8-150]
R1  Res  value 1K  [2012[0805]]
R2  Res  value 10K  [2012[0805]]

### Ports
CONTROL (in), LOAD + (out), LOAD - (in), SUPPLY_POS (in), SUPPLY_RETURN (out)

### Nets
CONTROL: CONTROL1.1(TEST) Q1.4(G) R2.2 ; port CONTROL
LOAD +: D1.1(A) D2.3 ; port SUPPLY_POS, port LOAD +
LOAD -: D2.1 Q1.5(D) Q1.6(D) Q1.7(D) Q1.8(D) R1.1 ; port LOAD -
SUPPLY_RETURN: Q1.1(S) Q1.2(S) Q1.3(S) R2.1 ; port SUPPLY_RETURN
NetD1_2: D1.2(K) R1.2

### Channels
PCDC/SW: designators CONTROL1=CONTROL1_PCDC_SW D1=D1_SW5 D2=D2_SW5 Q1=Q1_SW5 R1=R1_SW5 R2=R2_SW5; ports CONTROL=CONT_PRE LOAD +=DC_POWER LOAD -=LOAD - SUPPLY_POS=DC_POWER SUPPLY_RETURN=GND
AIR/SW: designators CONTROL1=CONTROL1_AIR_SW#1 D1=D1_SW4 D2=D2_SW4 Q1=Q1_SW4 R1=R1_SW4 R2=R2_SW4; ports CONTROL=CONT_NEG LOAD +=DC_POWER LOAD -=LOAD - SUPPLY_POS=DC_POWER SUPPLY_RETURN=GND
AIR/SW: designators CONTROL1=CONTROL1_AIR_SW#2 D1=D1_SW1 D2=D2_SW1 Q1=Q1_SW1 R1=R1_SW1 R2=R2_SW1; ports CONTROL=CONT_POS LOAD +=DC_POWER LOAD -=LOAD - SUPPLY_POS=DC_POWER SUPPLY_RETURN=GND
CHRG/SW: designators CONTROL1=CONTROL1_CHRG_SW D1=D1_SW3 D2=D2_SW3 Q1=Q1_SW3 R1=R1_SW3 R2=R2_SW3; ports CONTROL=CONT_CHARGE LOAD +=12V LOAD -=LOAD - SUPPLY_POS=12V SUPPLY_RETURN=GND
ICS/SW: designators end in _ICS_SW; ports CONTROL=CONTROL LOAD +=DC_POWER LOAD -=LOAD - SUPPLY_POS=DC_POWER SUPPLY_RETURN=GND
DCDC/SW: designators end in _DCDC_SW; ports CONTROL=CONT_DC_DC LOAD +=DC_POWER LOAD -=LOAD - SUPPLY_POS=DC_POWER SUPPLY_RETURN=GND

### Notes on the sheet
- (in symbol DMS3015SSS) 5, 6, 7, 8; 1, 2, 3

### Library data of the parts
CONTROL1 = Test Point: as BSPD_DEMO on sheet E17-04_BSPD
D1 = OVS5MBBCR4: Typical BLUE LED; Published: 8-Jun-2000; LatestRevisionDate: 17-Jul-2002; LatestRevisionNote: Re-released for DXP Platform.; PackageDocument: Feb-2002; PackageReference: 3.2X1.6X1.1; Publisher: Altium Limited; Supplier 1: Digi-Key; Supplier Part Number 1: 365-1544-1-ND
D2 = PMEG4010ET: SCHOTTKY RECT 40V 1A SOT-23; Supplier 1: Digi-Key; Supplier Part Number 1: 568-4103-6-ND
Q1 = DMS3015SSS: N-Channel Power MOSFET; Supplier 1: Digi-Key
R1 R2 = Res: Surface Mount Resistor; Published: 8-Jun-2000; LatestRevisionDate: 17-Jul-2002; LatestRevisionNote: Re-released for DXP Platform.; PackageReference: AXIAL-0.5; Publisher: Altium Limited

## Sheet E17-04-CONTACTOR_CONTROL.SchDoc
size A; DocumentNumber: 2; SheetNumber: 2; SheetTotal: 18
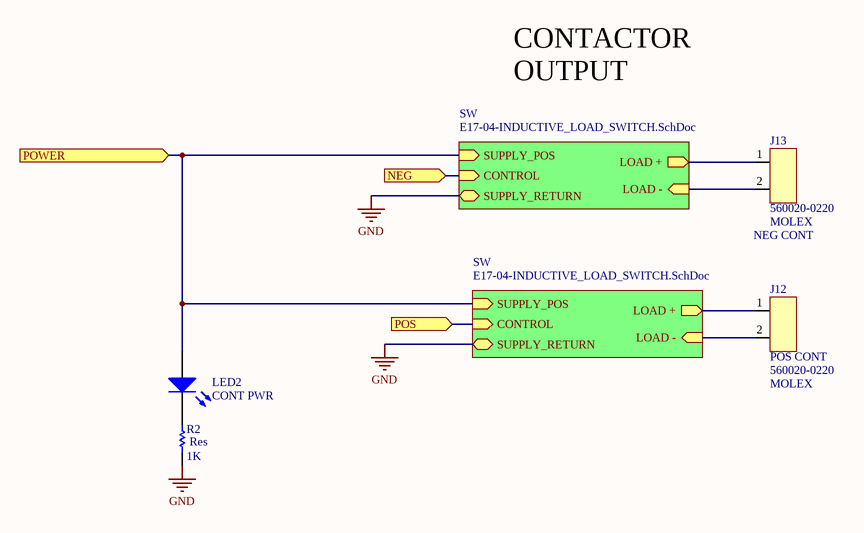
[diagram p7: E17-04-CONTACTOR_CONTROL.SchDoc]

### Parts
(Parts that share a designator on the sheet are numbered #1, #2 ... from top to bottom, then left to right.)
J12  POS CONT  MANUFACTURER: MOLEX  [MOLEX_DURACLIK_2 NAT VERT]
J13  NEG CONT  MANUFACTURER: MOLEX  [MOLEX_DURACLIK_2 NAT VERT]
LED2#1  CONT PWR  [155124VS73200]
R2#1  Res  value 1K  [2012[0805]]

### Sub-sheets
SW = E17-04-INDUCTIVE_LOAD_SWITCH.SchDoc: CONTROL (in), LOAD + (out), SUPPLY_POS (in), LOAD - (in), SUPPLY_RETURN
SW = E17-04-INDUCTIVE_LOAD_SWITCH.SchDoc: CONTROL (in), LOAD + (out), SUPPLY_POS (in), LOAD - (in), SUPPLY_RETURN

### Ports
NEG (in), POS (in), POWER (in)

### Nets
GND: R2#1.1 ; sheet SW/SUPPLY_RETURN, sheet SW/SUPPLY_RETURN
CONT_NEG: port NEG, sheet SW/CONTROL
CONT_POS: port POS, sheet SW/CONTROL
DC_POWER: J12.1 J13.1 LED2#1.2 ; port POWER, sheet SW/LOAD +, sheet SW/SUPPLY_POS, sheet SW/LOAD +, sheet SW/SUPPLY_POS
LOAD -: J13.2 ; sheet SW/LOAD -
LOAD -: J12.2 ; sheet SW/LOAD -  [a separate net that carries the same name]
NetLED2#1_1: LED2#1.1 R2#1.2

### Notes on the sheet
- CONTACTOR
  OUTPUT

### Library data of the parts
J12 J13 = 560020-0220: as J17 on sheet E17-04_BSPD; Digikey_PN: Not in production; COLOR: NAT; SERIES: Duraclik; ORIENTATOIN: VERT; MPN: 560020-0220; Comment_1: 560020-0220
LED2#1 = 155124VS73200: as LED7 on sheet E17-04_BSPD; Supplier 1: Digi-Key; Supplier Part Number 1: 732-5026-1-ND; RoHS: RoHS Compliant; Category: Optoelectronics; Stock 1: 4820; Pricing 1: 1=0.44, 50=0.3802, 100=0.3476, 500=0.31498, 1000=0.29326 (CAD); Packaging: Cut Tape (CT); Color: Green; Voltage - Forward (Vf) (Typ): 2V; Mounting Type: Surface Mount, Right Angle; Features: -; Package / Case: 2-SMD, Side View; Supplier Device Package: 1204; Size / Dimension: 3.20mm L x 1.50mm W; Height (Max): 1.20mm; ComponentLink1URL: http://katalog.we-online.de/led/datasheet/155124VS73200.pdf; ComponentLink1Description: http://katalog.we-online.de/led/datasheet/155124VS73200.pdf; Manufacturer Part Number: 155124VS73200
R2#1 = Res: Surface Mount Resistor; Published: 8-Jun-2000; LatestRevisionDate: 17-Jul-2002; LatestRevisionNote: Re-released for DXP Platform.; PackageReference: AXIAL-0.5; Publisher: Altium Limited

## Sheet E17-04-ISO_SPI.SchDoc
size A; DocumentNumber: 3; SheetNumber: 3; SheetTotal: 18
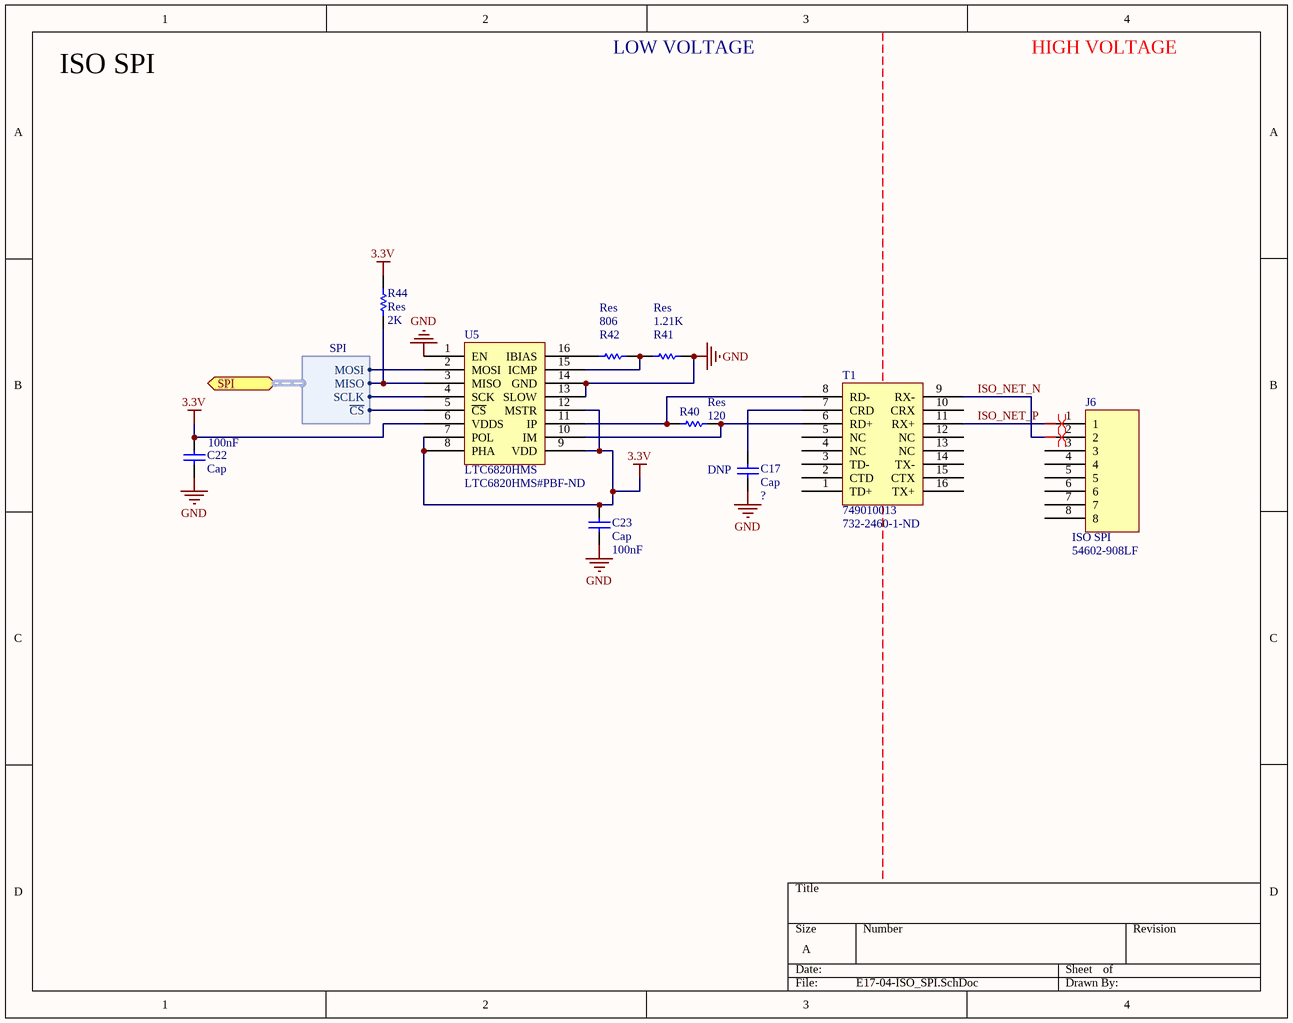
[diagram p8: E17-04-ISO_SPI.SchDoc]

### Parts
C17  Cap  STUFF: DNP  [C0805]
C22  Cap  value 100nF  [C0805]
C23  Cap  value 100nF  [C0805]
J6  ISO SPI  [54602-908LF]
R40  Res  value 120  [2012[0805]]
R41  Res  value 1.21K  [2012[0805]]
R42  Res  value 806  [2012[0805]]
R44  Res  value 2K  [2012[0805]]
T1  749010013  Supplier Part Number 1: 732-2460-1-ND  [749010013]
U5  LTC6820HMS  Supplier Part Number 1: LTC6820HMS#PBF-ND  [LTC6820HMS]

### Ports
SPI (harness SPI)

### Harnesses
SPI: ~{CS}, MOSI, MISO, SCLK

### Nets
3.3V: C22.2 C23.2 R44.1 U5.6(VDDS) U5.7(POL) U5.8(PHA) U5.9(VDD) U5.12(MSTR)
GND: C17.1 C22.1 C23.1 R41.1 U5.1(EN) U5.13(SLOW) U5.14(GND)
ISO_NET_N: J6.2 T1.9(RX-)
ISO_NET_P: J6.1 T1.11(RX+)
ISO_SPI.~{CS}: U5.5(~{CS}) ; port SPI.~{CS}
ISO_SPI.MISO: R44.2 U5.3(MISO) ; port SPI.MISO
ISO_SPI.MOSI: U5.2(MOSI) ; port SPI.MOSI
ISO_SPI.SCLK: U5.4(SCK) ; port SPI.SCLK
NetC17_2: C17.2 T1.7(CRD)
NetR40_1: R40.1 T1.6(RD+) U5.10(IM)
NetR40_2: R40.2 T1.8(RD-) U5.11(IP)
NetR41_2: R41.2 R42.1 U5.15(ICMP)
NetR42_2: R42.2 U5.16(IBIAS)

Not connected (* = marked no-connect by the designer): J6 3 4 5 6 7 8; T1 1(TD+) 2(CTD) 3(TD-) 4(NC) 5(NC) 10(CRX) 12(NC) 13(NC) 14(TX-) 15(CTX) 16(TX+)

### Layout directives
differential pair: ISO_NET_N, ISO_NET_P

### Notes on the sheet
- ISO SPI
- LOW VOLTAGE
- HIGH VOLTAGE

### Library data of the parts
C17 C22 C23 = Cap: Capacitor; Published: 8-Jun-2000; LatestRevisionDate: 17-Jul-2002; LatestRevisionNote: Re-released for DXP Platform.; PackageReference: C1206; Publisher: Altium Limited
  C17: Value: ?
J6 = 54602-908LF: CONN MOD JACK R/A 8P8C; Supplier 1: Digi-Key; Supplier Part Number 1: 609-1046-ND; MPN: 54602-908LF
R40-R42 R44 = Res: Surface Mount Resistor; Published: 8-Jun-2000; LatestRevisionDate: 17-Jul-2002; LatestRevisionNote: Re-released for DXP Platform.; PackageReference: AXIAL-0.5; Publisher: Altium Limited
T1 = 749010013: TRANSFORMER LAN 10/100 SMD; Supplier 1: Digi-Key
U5 = LTC6820HMS: IC COMM INTERFACE ISOSPI; Supplier 1: Digi-Key

## Sheet E17-04-TSVP.SchDoc
size A; DocumentNumber: 4; SheetNumber: 4; SheetTotal: 18
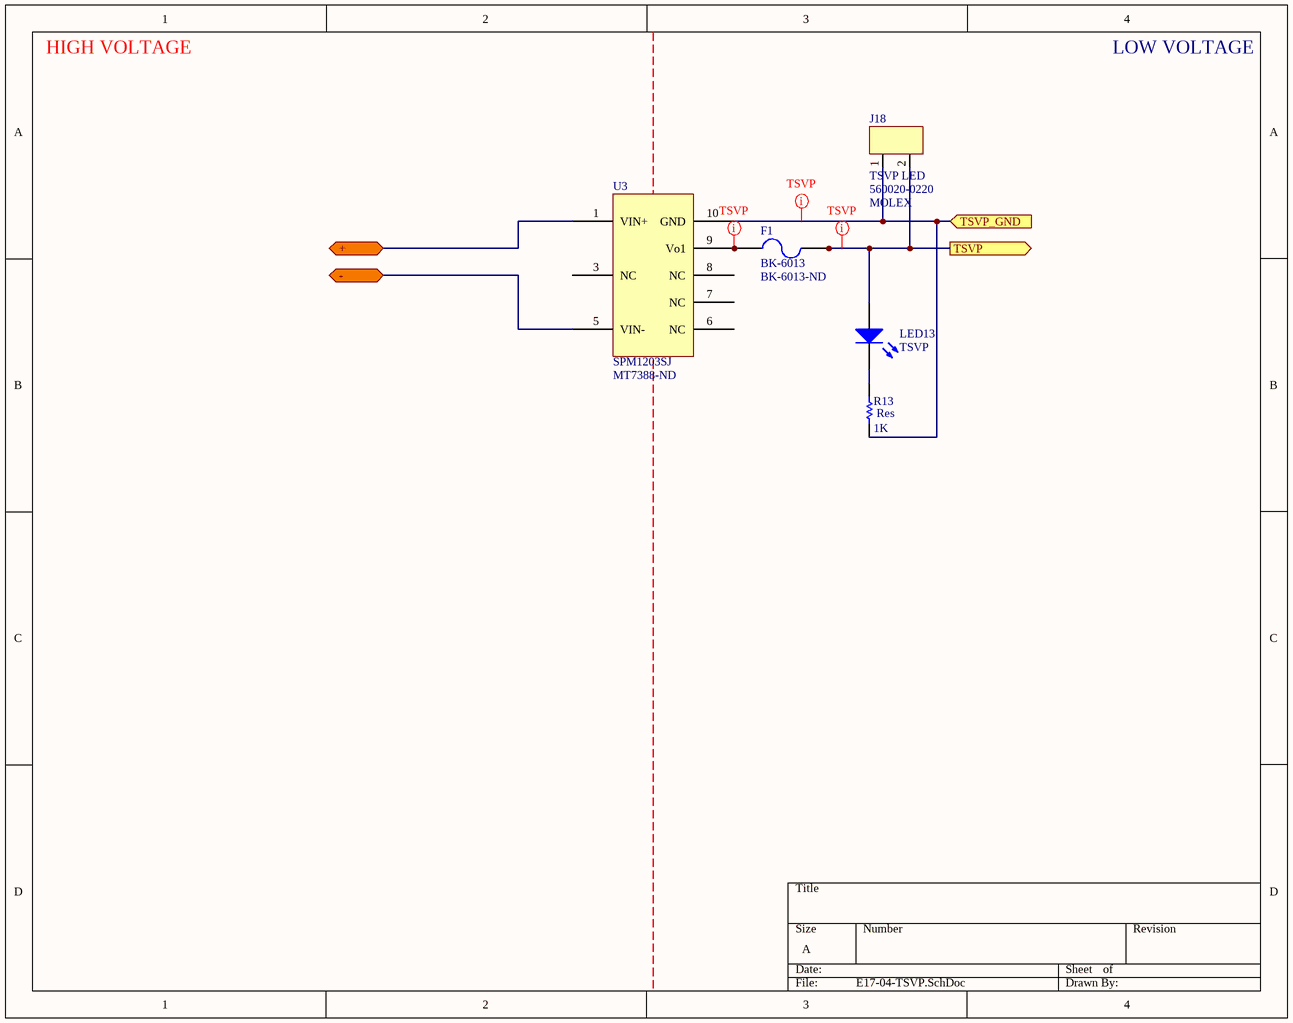
[diagram p9: E17-04-TSVP.SchDoc]

### Parts
F1  BK-6013  Supplier Part Number 1: BK-6013-ND  [BK-6013]
J18  TSVP LED  MANUFACTURER: MOLEX  [MOLEX_DURACLIK_2 NAT VERT]
LED13  TSVP  [155124VS73200]
R13  Res  value 1K  [2012[0805]]
U3  SPM1203SJ  Supplier Part Number 1: MT7388-ND  [SPM1203SJ]

### Ports
+, -, TSVP (out), TSVP_GND (in)

### Nets
HV_COM: U3.1(VIN+) ; port +
+: U3.5(VIN-) ; port -
TSAL: F1.3 F1.4 J18.2 LED13.2 ; port TSVP
TSAL GND: J18.1 R13.1 U3.10(GND) ; port TSVP_GND
NetF1_1: F1.1 F1.2 U3.9(Vo1)
NetLED13_1: LED13.1 R13.2

Not connected (* = marked no-connect by the designer): U3 3(NC) 6(NC) 7(NC) 8(NC)

### Layout directives
rule Undefined; rule Width Constraint [Pref Width = 25mil    Min Width = 20mil    Max Width = 30mil]: NetF1_1, TSAL, TSAL GND

### Notes on the sheet
- HIGH VOLTAGE
- LOW VOLTAGE

### Library data of the parts
F1 = BK-6013: FUSE HOLDER BLADE PCB; Supplier 1: Digi-Key
J18 = 560020-0220: as J17 on sheet E17-04_BSPD; Digikey_PN: Not in production; COLOR: NAT; SERIES: Duraclik; ORIENTATOIN: VERT; MPN: 560020-0220; Comment_1: 560020-0220
LED13 = 155124VS73200: as LED7 on sheet E17-04_BSPD; Supplier 1: Digi-Key; Supplier Part Number 1: 732-5026-1-ND; RoHS: RoHS Compliant; Category: Optoelectronics; Stock 1: 4820; Pricing 1: 1=0.44, 50=0.3802, 100=0.3476, 500=0.31498, 1000=0.29326 (CAD); Packaging: Cut Tape (CT); Color: Green; Voltage - Forward (Vf) (Typ): 2V; Mounting Type: Surface Mount, Right Angle; Features: -; Package / Case: 2-SMD, Side View; Supplier Device Package: 1204; Size / Dimension: 3.20mm L x 1.50mm W; Height (Max): 1.20mm; ComponentLink1URL: http://katalog.we-online.de/led/datasheet/155124VS73200.pdf; ComponentLink1Description: http://katalog.we-online.de/led/datasheet/155124VS73200.pdf; Manufacturer Part Number: 155124VS73200
R13 = Res: Surface Mount Resistor; Published: 8-Jun-2000; LatestRevisionDate: 17-Jul-2002; LatestRevisionNote: Re-released for DXP Platform.; PackageReference: AXIAL-0.5; Publisher: Altium Limited
U3 = SPM1203SJ: Supplier 1: Digi-Key

## Sheet E17-04-MCU.SchDoc
size A4; DocumentNumber: 5; SheetNumber: 5; SheetTotal: 18
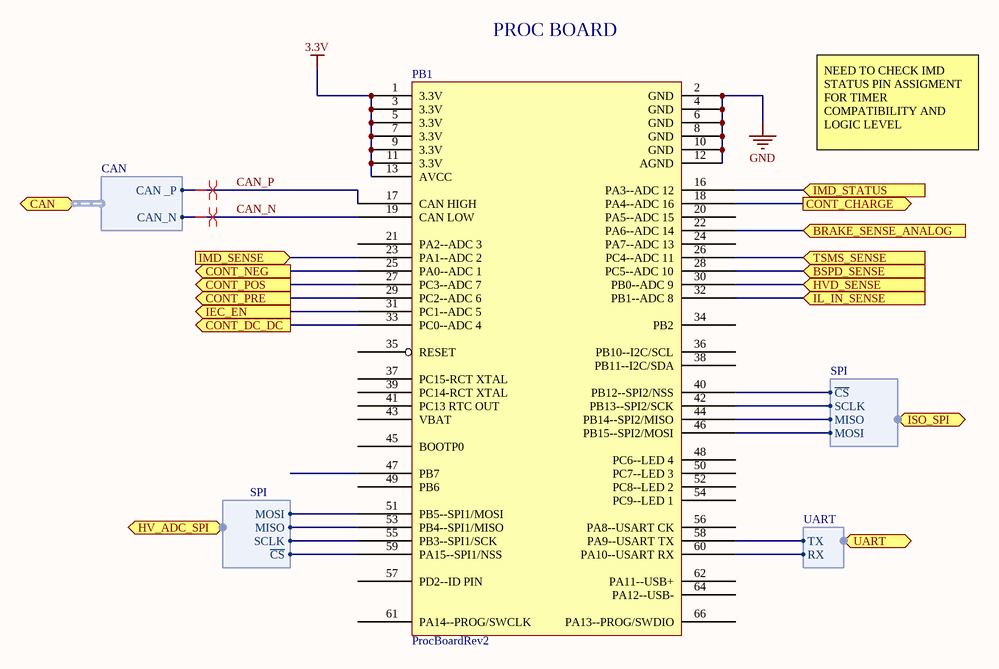
[diagram p10: E17-04-MCU.SchDoc]

### Parts
PB1  ProcBoardRev2  [PROC_BOARD]

### Ports
BRAKE_SENSE_ANALOG (in), BSPD_SENSE (in), CAN (harness CAN), CONT_CHARGE (out), CONT_DC_DC (out), CONT_NEG (out), CONT_POS (out), CONT_PRE (out), HV_ADC_SPI (harness SPI), HVD_SENSE (in), IEC_EN (out), IL_IN_SENSE (in), IMD_SENSE (in), IMD_STATUS (in), ISO_SPI (harness SPI), TSMS_SENSE (in), UART (harness UART)

### Harnesses
CAN: CAN _P, CAN_N
SPI: ~{CS}, MOSI, MISO, SCLK
UART: RX, TX

### Nets
3.3V: PB1.1(3.3V) PB1.3(3.3V) PB1.5(3.3V) PB1.7(3.3V) PB1.9(3.3V) PB1.11(3.3V) PB1.13(AVCC)
GND: PB1.2(GND) PB1.4(GND) PB1.6(GND) PB1.8(GND) PB1.10(GND) PB1.12(AGND)
~{IMD FAUL}T 3V3: PB1.23(PA1--ADC_2) ; port IMD_SENSE
BRAKE_SENSE_ANALOG: PB1.22(PA6--ADC_14) ; port BRAKE_SENSE_ANALOG
BRB_SENSE: PB1.32(PB1--ADC_8) ; port IL_IN_SENSE
BSPD_SENSE: PB1.28(PC5--ADC_10) ; port BSPD_SENSE
CAN_N: PB1.19(CAN_LOW) ; port CAN.CAN_N
CAN_P: PB1.17(CAN_HIGH) ; port CAN.CAN _P
CONT_CHARGE: PB1.18(PA4--ADC_16) ; port CONT_CHARGE
CONT_DC_DC: PB1.33(PC0--ADC_4) ; port CONT_DC_DC
CONT_NEG: PB1.25(PA0--ADC_1) ; port CONT_NEG
CONT_POS: PB1.27(PC3--ADC_7) ; port CONT_POS
CONT_PRE: PB1.29(PC2--ADC_6) ; port CONT_PRE
CONTROL: PB1.31(PC1--ADC_5) ; port IEC_EN
HVD_SENSE: PB1.30(PB0--ADC_9) ; port HVD_SENSE
IMD_STATUS: PB1.16(PA3--ADC_12) ; port IMD_STATUS
ISO_SPI.~{CS}: PB1.40(PB12--SPI2/NSS) ; port ISO_SPI.~{CS}
ISO_SPI.MISO: PB1.44(PB14--SPI2/MISO) ; port ISO_SPI.MISO
ISO_SPI.MOSI: PB1.46(PB15--SPI2/MOSI) ; port ISO_SPI.MOSI
ISO_SPI.SCLK: PB1.42(PB13--SPI2/SCK) ; port ISO_SPI.SCLK
out: PB1.60(PA10--USART_RX) ; port UART.RX
TSMS_SENSE: PB1.26(PC4--ADC_11) ; port TSMS_SENSE
NetPB1_51: PB1.51(PB5--SPI1/MOSI) ; port HV_ADC_SPI.MOSI
NetPB1_53: PB1.53(PB4--SPI1/MISO) ; port HV_ADC_SPI.MISO
NetPB1_55: PB1.55(PB3--SPI1/SCK) ; port HV_ADC_SPI.SCLK
NetPB1_58: PB1.58(PA9--USART_TX) ; port UART.TX
NetPB1_59: PB1.59(PA15--SPI1/NSS) ; port HV_ADC_SPI.~{CS}

Not connected (* = marked no-connect by the designer): PB1 14(NC) 15(NC) 20(PA5--ADC_15) 21(PA2--ADC_3) 24(PA7--ADC_13) 34(PB2) 35(RESET) 36(PB10--I2C/SCL) 37(PC15-RCT_XTAL) 38(PB11--I2C/SDA) 39(PC14-RCT_XTAL) 41(PC13_RTC_OUT) 43(VBAT) 45(BOOTP0) 47(PB7) 48(PC6--LED_4) 49(PB6) 50(PC7--LED_3) 52(PC8--LED_2) 54(PC9--LED_1) 56(PA8--USART_CK) 57(PD2--ID_PIN) 61(PA14--PROG/SWCLK) 62(PA11--USB+) 63(NC) 64(PA12--USB-) 65(NC) 66(PA13--PROG/SWDIO) 67

### Layout directives
differential pair: CAN_N, CAN_P

### Notes on the sheet
- PROC BOARD
- NEED TO CHECK IMD STATUS PIN ASSIGMENT FOR TIMER COMPATIBILITY AND LOGIC LEVEL

### Library data of the parts
PB1 = ProcBoardRev2: Processor board that carries the STM32F072RB

## Sheet E17-04-HV_MEASURE.SchDoc
size A; DocumentNumber: 6; SheetNumber: 6; SheetTotal: 17
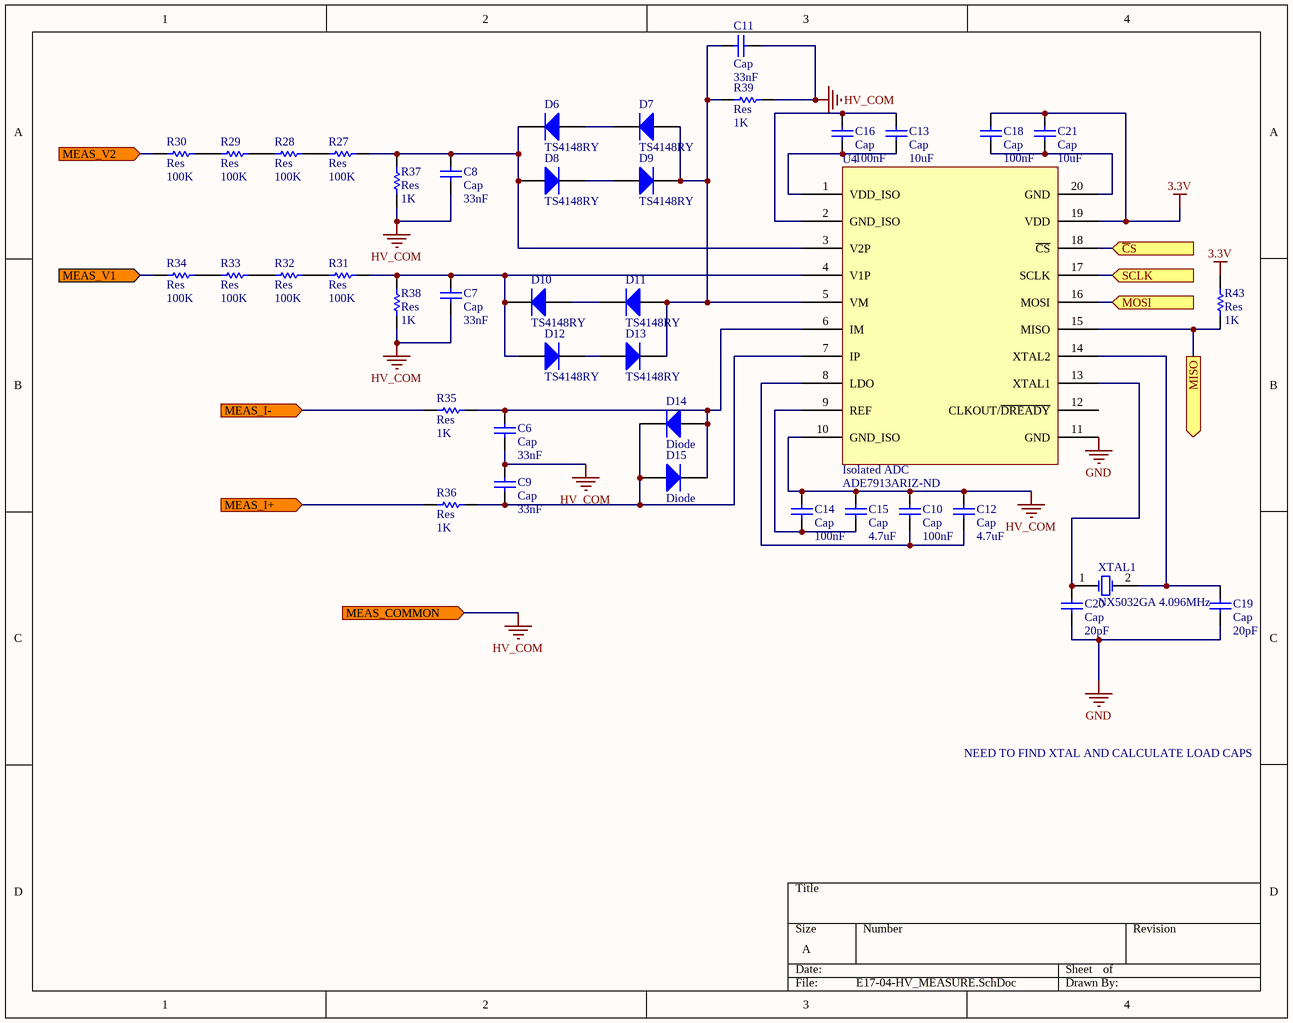
[diagram p11: E17-04-HV_MEASURE.SchDoc]

### Parts
C6  Cap  value 33nF  [C0805]
C7  Cap  value 33nF  [C0805]
C8  Cap  value 33nF  [C0805]
C9  Cap  value 33nF  [C0805]
C10  Cap  value 100nF  [C0805]
C11  Cap  value 33nF  [C0805]
C12  Cap  value 4.7uF  [C0805]
C13  Cap  value 10uF  [C0805]
C14  Cap  value 100nF  [C0805]
C15  Cap  value 4.7uF  [C0805]
C16  Cap  value 100nF  [C0805]
C18  Cap  value 100nF  [C0805]
C19  Cap  value 20pF  [C0805]
C20  Cap  value 20pF  [C0805]
C21  Cap  value 10uF  [C0805]
D6  TS4148RY  [DIOC2012X09N]
D7  TS4148RY  [DIOC2012X09N]
D8  TS4148RY  [DIOC2012X09N]
D9  TS4148RY  [DIOC2012X09N]
D10  TS4148RY  [DIOC2012X09N]
D11  TS4148RY  [DIOC2012X09N]
D12  TS4148RY  [DIOC2012X09N]
D13  TS4148RY  [DIOC2012X09N]
D14  Diode  [SMC]
D15  Diode  [SMC]
R27  Res  value 100K  [3216[1206]]
R28  Res  value 100K  [3216[1206]]
R29  Res  value 100K  [3216[1206]]
R30  Res  value 100K  [3216[1206]]
R31  Res  value 100K  [3216[1206]]
R32  Res  value 100K  [3216[1206]]
R33  Res  value 100K  [3216[1206]]
R34  Res  value 100K  [3216[1206]]
R35  Res  value 1K  [2012[0805]]
R36  Res  value 1K  [2012[0805]]
R37  Res  value 1K  [2012[0805]]
R38  Res  value 1K  [2012[0805]]
R39  Res  value 1K  [2012[0805]]
R43  Res  value 1K  [2012[0805]]
U4  Isolated ADC  Supplier Part Number 1: ADE7913ARIZ-ND  [SOIC127P1030X265-20N]
XTAL1  NX5032GA 4.096MHz  [NX5032GA]

### Ports
MEAS_COMMON (in), MEAS_I+ (in), MEAS_I- (in), MEAS_V1 (in), MEAS_V2 (in), MISO (out), MOSI (in), SCLK (in), ~{C}S (in)

### Nets
3.3V: C18.1 C21.1 R43.1 U4.19(VDD)
GND: C19.1 C20.1 U4.11(GND)
HV_COM: C6.1 C7.1 C8.1 C9.2 C10.1 C11.1 C12.1 C14.1 C15.1 R37.1 R38.1 R39.1 U4.10(GND_ISO) ; port MEAS_COMMON
+: R34.1 ; port MEAS_V1
~{C}S: U4.18(~{CS}) ; port ~{C}S
HV_HVD: R30.1 ; port MEAS_V2
HV_SHUNT_NEG: R35.2 ; port MEAS_I-
HV_SHUNT_POS: R36.2 ; port MEAS_I+
MISO: R43.2 U4.15(MISO) ; port MISO
MOSI: U4.16(MOSI) ; port MOSI
SCLK: U4.17(SCLK) ; port SCLK
NetC6_2: C6.2 D14.1(A) D15.2(K) R35.1 U4.6(IM)
NetC7_2: C7.2 D10.2(K) D12.1(A) R31.2 R38.2 U4.4(V1P)
NetC8_2: C8.2 D6.2(K) D8.1(A) R27.2 R37.2 U4.3(V2P)
NetC9_1: C9.1 D14.2(K) D15.1(A) R36.1 U4.7(IP)
NetC10_2: C10.2 C12.2 U4.8(LDO)
NetC11_2: C11.2 D7.1(A) D9.2(K) D11.1(A) D13.2(K) R39.2 U4.5(VM)
NetC13_1: C13.1 C16.1 U4.2(GND_ISO)
NetC13_2: C13.2 C16.2 U4.1(VDD_ISO)
NetC14_2: C14.2 C15.2 U4.9(REF)
NetC18_2: C18.2 C21.2 U4.20(GND)
NetC19_2: C19.2 U4.14(XTAL2) XTAL1.2(OSC2)
NetC20_2: C20.2 U4.13(XTAL1) XTAL1.1(OSC1)
NetD6_2: D6.2(K) D7.2(K)
NetD8_1: D8.1(A) D9.1(A)
NetD10_2: D10.2(K) D11.2(K)
NetD12_2: D12.2(K) D13.1(A)
NetR27_1: R27.1 R28.2
NetR28_1: R28.1 R29.2
NetR29_1: R29.1 R30.2
NetR31_1: R31.1 R32.2
NetR32_1: R32.1 R33.2
NetR33_1: R33.1 R34.2

Not connected (* = marked no-connect by the designer): U4 12(CLKOUT/~{DREADY})

### Notes on the sheet
- NEED TO FIND XTAL AND CALCULATE LOAD CAPS

### Library data of the parts
C6-C16 C18-C21 = Cap: Capacitor; Published: 8-Jun-2000; LatestRevisionDate: 17-Jul-2002; LatestRevisionNote: Re-released for DXP Platform.; PackageReference: C1206; Publisher: Altium Limited
D6-D15 = Diode: Default Diode; Published: 8-Jun-2000; LatestRevisionDate: 17-Jul-2002; LatestRevisionNote: Re-released for DXP Platform.; PackageVersion: Sep-1996; PackageReference: SMC; Publisher: Altium Limited; PackageDescription: DO-214-AB/SMC; 2 C-Bend Leads; Body 7.9 x 5.9 mm, inc. leads (LxW); Code_JEDEC: DO-214-AB
R27-R39 R43 = Res: Surface Mount Resistor; Published: 8-Jun-2000; LatestRevisionDate: 17-Jul-2002; LatestRevisionNote: Re-released for DXP Platform.; PackageReference: AXIAL-0.5; Publisher: Altium Limited
U4 = ADE7913: 3-Channel, Isolated, Sigma Delta ADC with SPI; Supplier 1: Digi-Key
XTAL1 = NX5032GA

## Sheet E17-04-POWER.SchDoc
size A; DocumentNumber: 9; SheetNumber: 9; SheetTotal: 18
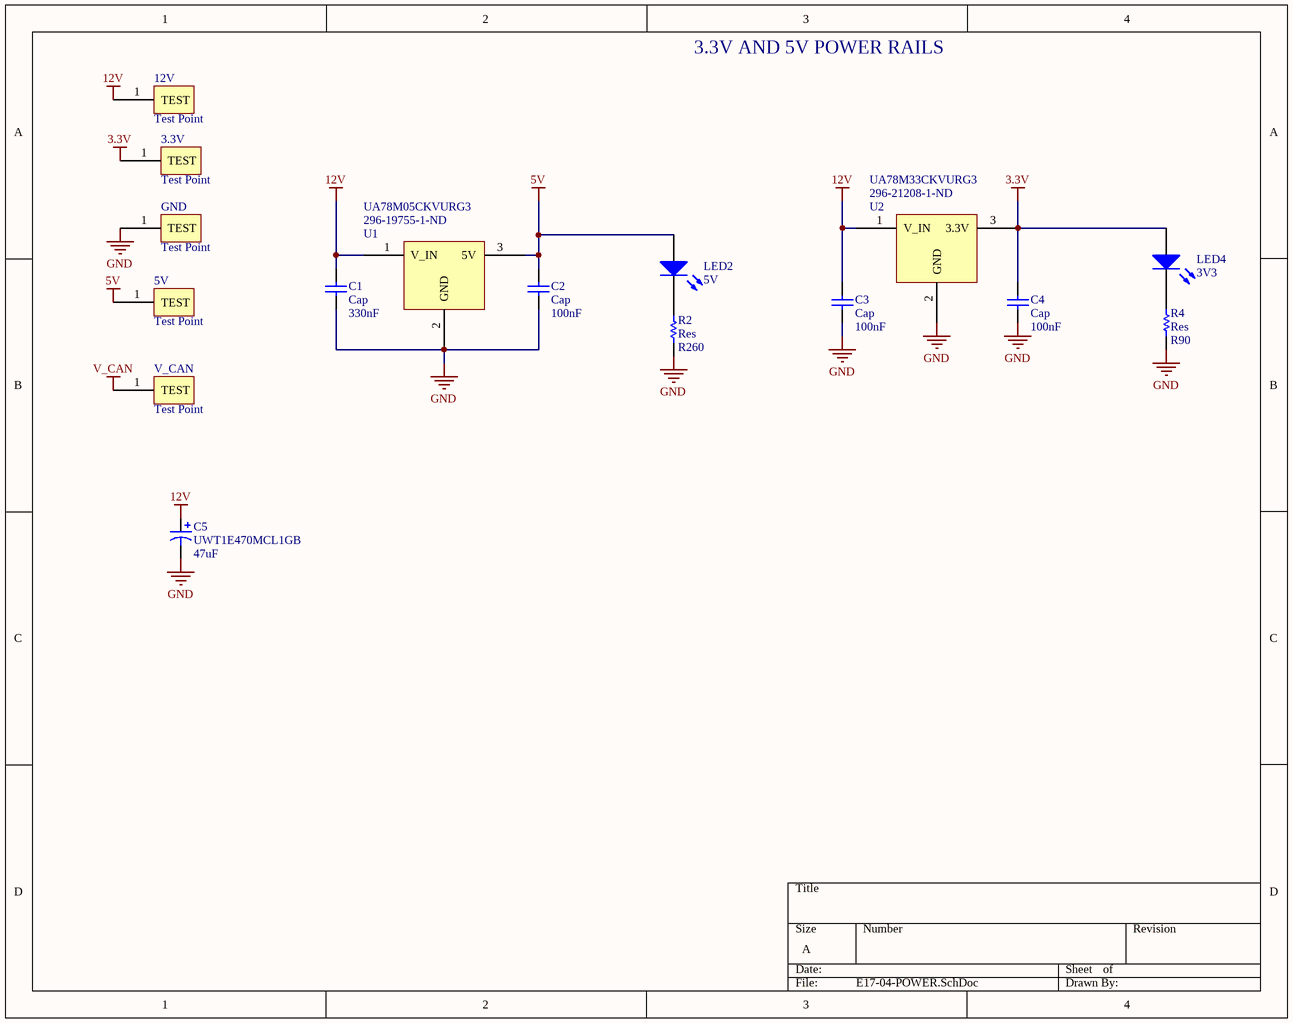
[diagram p12: E17-04-POWER.SchDoc]

### Parts
(Parts that share a designator on the sheet are numbered #1, #2 ... from top to bottom, then left to right.)
3.3V  Test Point  [TEST POINT 5000K]
5V  Test Point  [TEST POINT 5000K]
12V  Test Point  [TEST POINT 5000K]
C1  Cap  value 330nF  [C0805]
C2  Cap  value 100nF  [C0805]
C3  Cap  value 100nF  [C0805]
C4  Cap  value 100nF  [C0805]
C5  UWT1E470MCL1GB  value 47uF  [UWT1E470MCL1GB]
GND  Test Point  [TEST POINT 5000K]
LED2#2  5V  [155124VS73200]
LED4  3V3  [155124VS73200]
R2#2  Res  value R260  [2012[0805]]
R4  Res  value R90  [2012[0805]]
U1  UA78M05CKVURG3  Supplier Part Number 1: 296-19755-1-ND  [TO-252-3]
U2  UA78M33CKVURG3  Supplier Part Number 1: 296-21208-1-ND  [TO-252-3]
V_CAN  Test Point  [TEST POINT 5000K]

### Nets
3.3V: 3.3V.1(TEST) C4.2 LED4.2 U2.3(3.3V)
5V: 5V.1(TEST) C2.2 LED2#2.2 U1.3(5V)
12V: 12V.1(TEST) C1.2 C3.2 C5.1 U1.1(V_IN) U2.1(V_IN)
GND: C1.1 C2.1 C3.1 C4.1 C5.2 GND.1(TEST) R2#2.1 R4.1 U1.2(GND) U2.2(GND)
V_CAN: V_CAN.1(TEST)
NetLED2#2_1: LED2#2.1 R2#2.2
NetLED4_1: LED4.1 R4.2

### Notes on the sheet
- 3.3V AND 5V POWER RAILS

### Library data of the parts
3.3V 5V 12V GND V_CAN = Test Point: as BSPD_DEMO on sheet E17-04_BSPD
C1-C4 = Cap: Capacitor; Published: 8-Jun-2000; LatestRevisionDate: 17-Jul-2002; LatestRevisionNote: Re-released for DXP Platform.; PackageReference: C1206; Publisher: Altium Limited
C5 = UWT1E470MCL1GB: CAP ALUM 47UF 25V 20% SMD; Published: 8-Jun-2000; LatestRevisionDate: 17-Jul-2002; LatestRevisionNote: Re-released for DXP Platform.; PackageReference: POLAR0.8; Publisher: Altium Limited; PackageDescription: Polarized Capacitor; 2 Leads
LED2#2 LED4 = 155124VS73200: as LED7 on sheet E17-04_BSPD; Supplier 1: Digi-Key; Supplier Part Number 1: 732-5026-1-ND; RoHS: RoHS Compliant; Category: Optoelectronics; Stock 1: 4820; Pricing 1: 1=0.44, 50=0.3802, 100=0.3476, 500=0.31498, 1000=0.29326 (CAD); Packaging: Cut Tape (CT); Color: Green; Voltage - Forward (Vf) (Typ): 2V; Mounting Type: Surface Mount, Right Angle; Features: -; Package / Case: 2-SMD, Side View; Supplier Device Package: 1204; Size / Dimension: 3.20mm L x 1.50mm W; Height (Max): 1.20mm; ComponentLink1URL: http://katalog.we-online.de/led/datasheet/155124VS73200.pdf; ComponentLink1Description: http://katalog.we-online.de/led/datasheet/155124VS73200.pdf; Manufacturer Part Number: 155124VS73200
R2#2 R4 = Res: Surface Mount Resistor; Published: 8-Jun-2000; LatestRevisionDate: 17-Jul-2002; LatestRevisionNote: Re-released for DXP Platform.; PackageReference: AXIAL-0.5; Publisher: Altium Limited
U1 = UA78M05CKVURG3: 5.0V Regulator; Supplier 1: Digi-Key
U2 = UA78M33CKVURG3: 3.3V Regulator; Supplier 1: Digi-Key

## Sheet E17-04-HVD.SchDoc
size A; DocumentNumber: 13; SheetNumber: 13; SheetTotal: 18
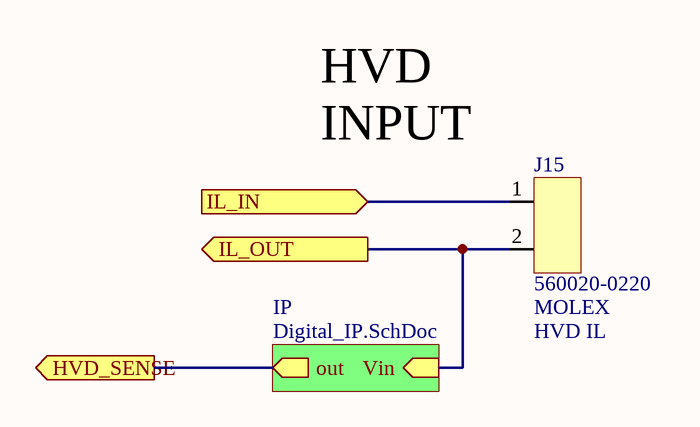
[diagram p13: E17-04-HVD.SchDoc]

### Parts
J15  HVD IL  MANUFACTURER: MOLEX  [MOLEX_DURACLIK_2 NAT VERT]

### Sub-sheets
IP = Digital_IP.SchDoc: Vin (in), out (out)

### Ports
HVD_SENSE (out), IL_IN (in), IL_OUT (out)

### Nets
HVD_SENSE: port HVD_SENSE, sheet IP/out
IL_IN: J15.1 ; port IL_IN
IL_IN: J15.2 ; port IL_OUT, sheet IP/Vin  [a separate net that carries the same name]

### Notes on the sheet
- (near J15) HVD
  INPUT

### Library data of the parts
J15 = 560020-0220: as J17 on sheet E17-04_BSPD; Digikey_PN: Not in production; COLOR: NAT; SERIES: Duraclik; ORIENTATOIN: VERT; MPN: 560020-0220

## Sheet E17-04-HV-CONNECTORS.SchDoc
size A; DocumentNumber: 16; SheetNumber: 16; SheetTotal: 18
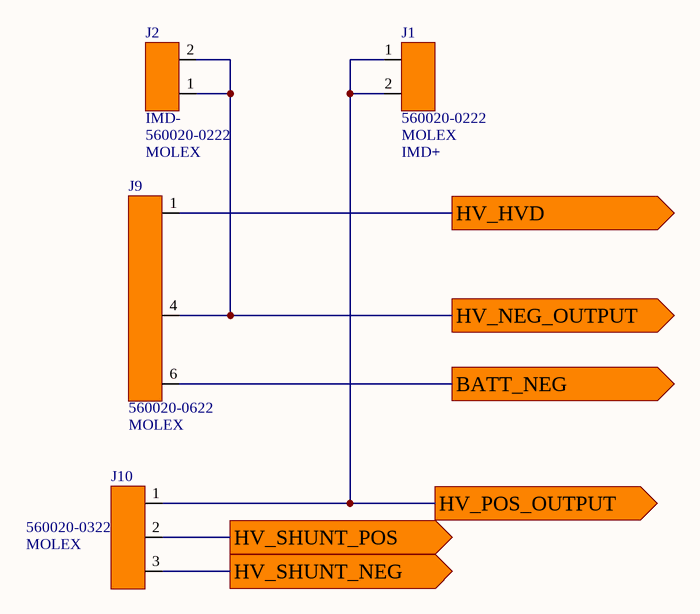
[diagram p14: E17-04-HV-CONNECTORS.SchDoc]

### Parts
J1  IMD+  MANUFACTURER: MOLEX  [MOLEX_DURACLIK_2 RED VERT]
J2  IMD-  MANUFACTURER: MOLEX  [MOLEX_DURACLIK_2 RED VERT]
J9  MPN: 560020-0622  MANUFACTURER: MOLEX  [MOLEX_DURACLIK_6 RED VERT HV]  (hidden comment: HV BUS)
J10  MANUFACTURER: MOLEX  [MOLEX_DURACLIK_3 RED - VERT]  (hidden comment: SHUNT)

### Ports
BATT_NEG (out), HV_HVD (out), HV_NEG_OUTPUT (out), HV_POS_OUTPUT (out), HV_SHUNT_NEG (out), HV_SHUNT_POS (out)

### Nets
HV_COM: J1.1 J1.2 J10.1 ; port HV_POS_OUTPUT
+: J2.1 J2.2 J9.4 ; port HV_NEG_OUTPUT
-: J9.6 ; port BATT_NEG
HV_HVD: J9.1 ; port HV_HVD
HV_SHUNT_NEG: J10.3 ; port HV_SHUNT_NEG
HV_SHUNT_POS: J10.2 ; port HV_SHUNT_POS

### Library data of the parts
J1 J2 = 560020-0222: MOLEX DURACLIK 2-PIN VERT RED; POSITIONS: 2; PLATING: Tin (Sn); CURRENT: 3; VOLTAGE: 125; UL: 94V-0; Digikey_PN: Not in production; COLOR: RED; SERIES: Duraclik; ORIENTATOIN: VERT; MPN: 560020-0222
J9 = 560020-0622_HV: MOLEX DURACLIK 6-PIN VERT RED; POSITIONS: 6; UL: 94V-0; VOLTAGE: 250; CURRENT: 3; PLATING: Tin (Sn); Digikey_PN: Not in production; COLOR: RED; SERIES: Duraclik; ORIENTATOIN: VERT
J10 = 560020-0322: MOLEX DURACLIK 3-PIN VERT RED; POSITIONS: 3; PLATING: Tin (Sn); VOLTAGE: 125; UL: 94V-0; Digikey_PN: Not in production; COLOR: RED; SERIES: Duraclik; ORIENTATOIN: VERT; CURRENT: 3; MPN: 560020-0322

## Sheet E17-04_Charger Control.SchDoc
size A; DocumentNumber: 17; SheetNumber: 17; SheetTotal: 18
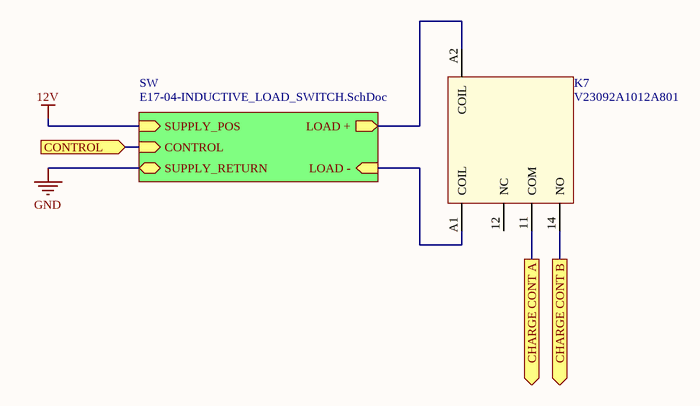
[diagram p15: E17-04_Charger Control.SchDoc]

### Parts
K7  V23092A1012A801  [SCHRACK]

### Sub-sheets
SW = E17-04-INDUCTIVE_LOAD_SWITCH.SchDoc: CONTROL (in), LOAD + (out), SUPPLY_POS (in), LOAD - (in), SUPPLY_RETURN

### Ports
CHARGE CONT A (out), CHARGE CONT B (out), CONTROL (in)

### Nets
12V: K7.A2(COIL) ; sheet SW/LOAD +, sheet SW/SUPPLY_POS
CHARGE CONT A: K7.11(COM) ; port CHARGE CONT A
CHARGE CONT B: K7.14(NO) ; port CHARGE CONT B
CONT_CHARGE: port CONTROL, sheet SW/CONTROL
LOAD -: K7.A1(COIL) ; sheet SW/LOAD -

Not connected (* = marked no-connect by the designer): K7 12(NC)

### Library data of the parts
K7 = V23092A1012A801: as K4 on sheet E17-04_BSPD; DIGIKEY_PN: PB2044-ND; Supplier 1: Digikey; Supplier Part Number 1: PB2044-ND; MFG_PN: V23092A1012A801

## Sheet E17-04_ICS.SchDoc
size A; DocumentNumber: 18; SheetNumber: 18; SheetTotal: 18
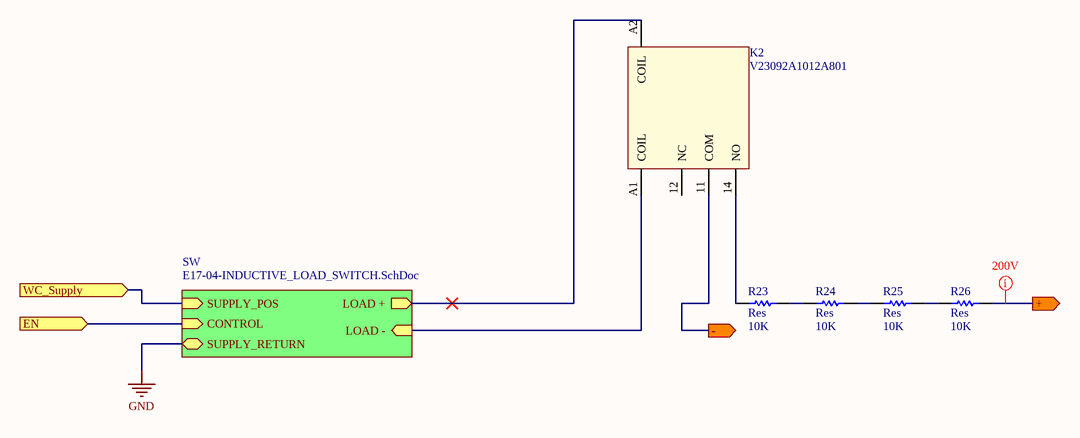
[diagram p16: E17-04_ICS.SchDoc]

### Parts
K2  V23092A1012A801  [SCHRACK]
R23  Res  value 10K  [3216[1206]]
R24  Res  value 10K  [3216[1206]]
R25  Res  value 10K  [3216[1206]]
R26  Res  value 10K  [3216[1206]]

### Sub-sheets
SW = E17-04-INDUCTIVE_LOAD_SWITCH.SchDoc: CONTROL (in), LOAD + (out), SUPPLY_POS (in), LOAD - (in), SUPPLY_RETURN

### Ports
+ (out), - (out), EN (in), WC_Supply (in)

### Nets
+: R26.2 ; port +
-: K2.11(COM) ; port -
CONTROL: port EN, sheet SW/CONTROL
DC_POWER: K2.A2(COIL) ; port WC_Supply, sheet SW/LOAD +, sheet SW/SUPPLY_POS
LOAD -: K2.A1(COIL) ; sheet SW/LOAD -
NetK2_14: K2.14(NO) R23.1
NetR23_2: R23.2 R24.1
NetR24_2: R24.2 R25.1
NetR25_2: R25.2 R26.1

Not connected (* = marked no-connect by the designer): K2 12(NC)

### Layout directives
rule Clearance Constraint [Generic clearance = 0.4mm, and 3 value(s) for objects]: +

### Library data of the parts
K2 = V23092A1012A801: as K4 on sheet E17-04_BSPD; DIGIKEY_PN: PB2044-ND; Supplier 1: Digikey; Supplier Part Number 1: PB2044-ND; MFG_PN: V23092A1012A801
R23-R26 = Res: Surface Mount Resistor; Published: 8-Jun-2000; LatestRevisionDate: 17-Jul-2002; LatestRevisionNote: Re-released for DXP Platform.; PackageReference: AXIAL-0.5; Publisher: Altium Limited

## Sheet map 5v to 3v3.SchDoc
size A
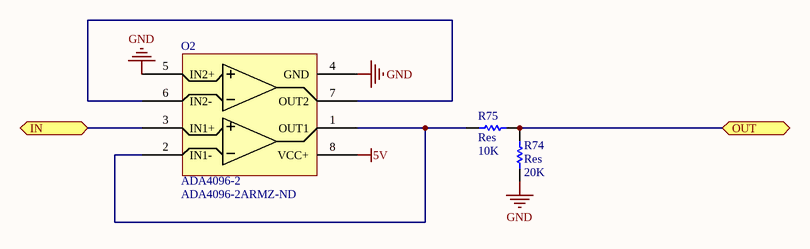
[diagram p17: map 5v to 3v3.SchDoc]

### Parts
O2  ADA4096-2  Supplier Part Number 1: ADA4096-2ARMZ-ND  [TSSOP8]
R74  Res  value 20K  [2012[0805]]
R75  Res  value 10K  [2012[0805]]

### Ports
IN, OUT

### Nets
5V: O2.8(VCC+)
GND: O2.4(GND) O2.5(IN2+) R74.2
BRAKE_SENSE: O2.3(IN1+) ; port IN
BRAKE_SENSE_ANALOG: R74.1 R75.1 ; port OUT
NetO2_1: O2.1(OUT1) O2.2(IN1-) R75.2
NetO2_6: O2.6(IN2-) O2.7(OUT2)

### Library data of the parts
O2 = ADA4096-2: as O1 on sheet E17-04_BSPD; Supplier 1: Digi-Key
R74 R75 = Res: Surface Mount Resistor; Published: 8-Jun-2000; LatestRevisionDate: 17-Jul-2002; LatestRevisionNote: Re-released for DXP Platform.; PackageReference: AXIAL-0.5; Publisher: Altium Limited

## Sheet E17-04-Energy_Meter.SchDoc
size A
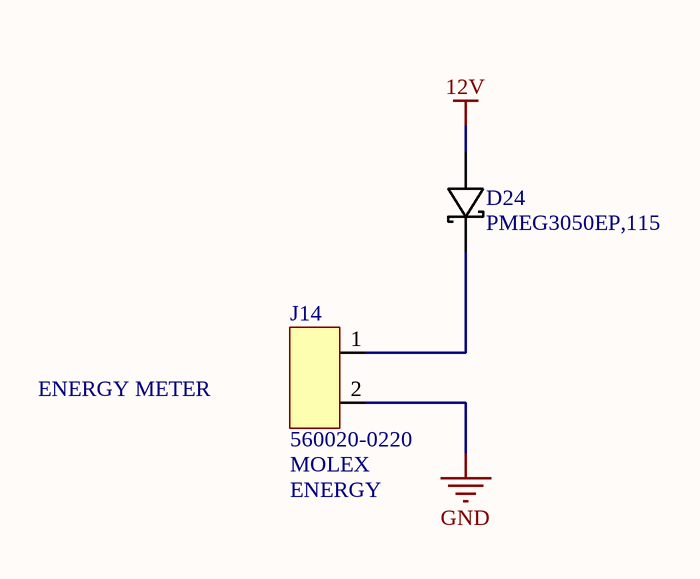
[diagram p18: E17-04-Energy_Meter.SchDoc]

### Parts
D24  MFG_PN: PMEG3050EP,115  [SOD-128]  (hidden comment: D_PMEG3050EP,115)
J14  ENERGY  MANUFACTURER: MOLEX  [MOLEX_DURACLIK_2 NAT VERT]

### Nets
12V: D24.1
GND: J14.2
NetD24_2: D24.2 J14.1

### Notes on the sheet
- ENERGY METER

### Library data of the parts
D24 = D_PMEG3050EP,115: DIODE SCHOTTKY 360mV 30V 5A; MFG: Nexperia; Supplier: Digikey; Supplier_PN: 1727-5317-1-ND
J14 = 560020-0220: as J17 on sheet E17-04_BSPD; Digikey_PN: Not in production; COLOR: NAT; SERIES: Duraclik; ORIENTATOIN: VERT; MPN: 560020-0220

## Sheet E17-04_DC_DC_CONTROL.SchDoc
size A
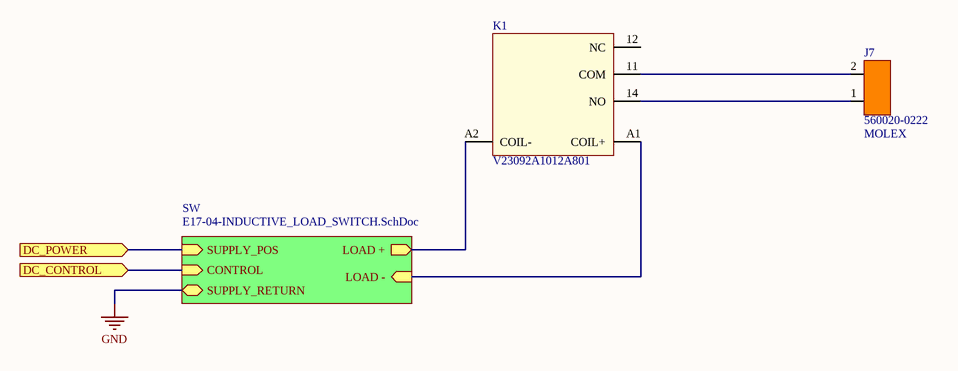
[diagram p19: E17-04_DC_DC_CONTROL.SchDoc]

### Parts
J7  MANUFACTURER: MOLEX  [MOLEX_DURACLIK_2 RED VERT]  (hidden comment: DC TO DC)
K1  V23092A1012A801  [SCHRACK]

### Sub-sheets
SW = E17-04-INDUCTIVE_LOAD_SWITCH.SchDoc: CONTROL (in), LOAD + (out), SUPPLY_POS (in), LOAD - (in), SUPPLY_RETURN

### Ports
DC_CONTROL (in), DC_POWER (in)

### Nets
CONT_DC_DC: port DC_CONTROL, sheet SW/CONTROL
DC_POWER: K1.A2(COIL-) ; port DC_POWER, sheet SW/LOAD +, sheet SW/SUPPLY_POS
LOAD -: K1.A1(COIL+) ; sheet SW/LOAD -
NetJ7_1: J7.1 K1.14(NO)
NetJ7_2: J7.2 K1.11(COM)

Not connected (* = marked no-connect by the designer): K1 12(NC)

### Library data of the parts
J7 = 560020-0222: as J1 on sheet E17-04-HV-CONNECTORS; Digikey_PN: Not in production; COLOR: RED; SERIES: Duraclik; ORIENTATOIN: VERT; MPN: 560020-0222
K1 = V23092A1012A801: as K4 on sheet E17-04_BSPD; DIGIKEY_PN: PB2044-ND; Supplier 1: Digikey; Supplier Part Number 1: PB2044-ND; MFG_PN: V23092A1012A801